# EasyEDA Pro project ProProject_训练营23_2023-12-06.epro, board PCB_PCB_不带频谱时钟_2_2023-11-23_2
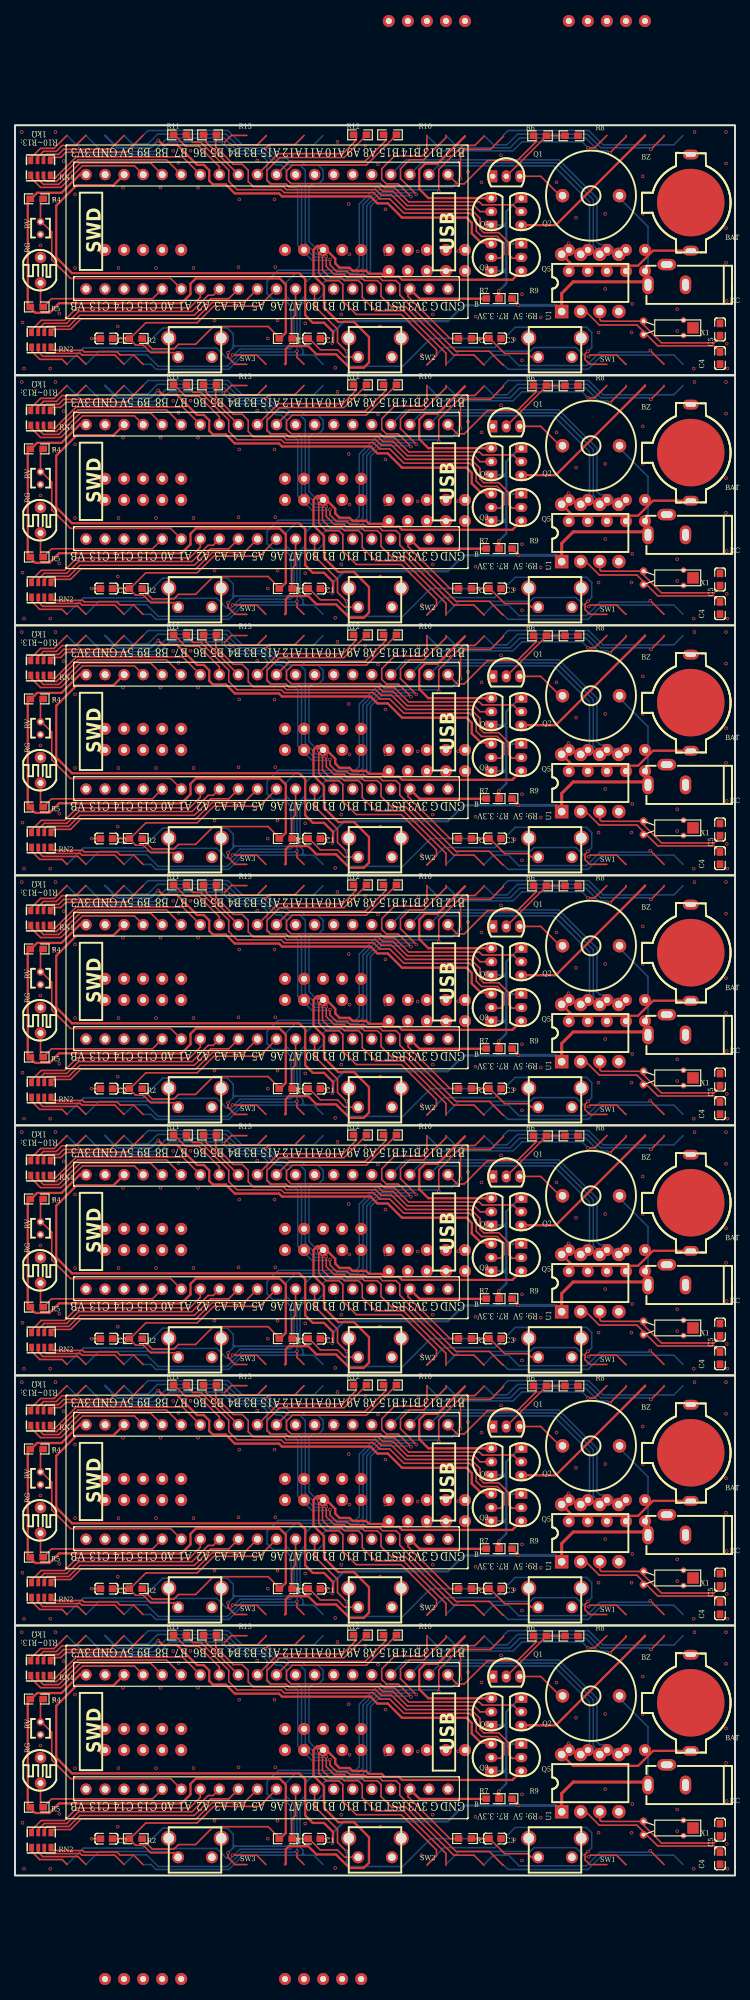
[diagram p3: board, top side]
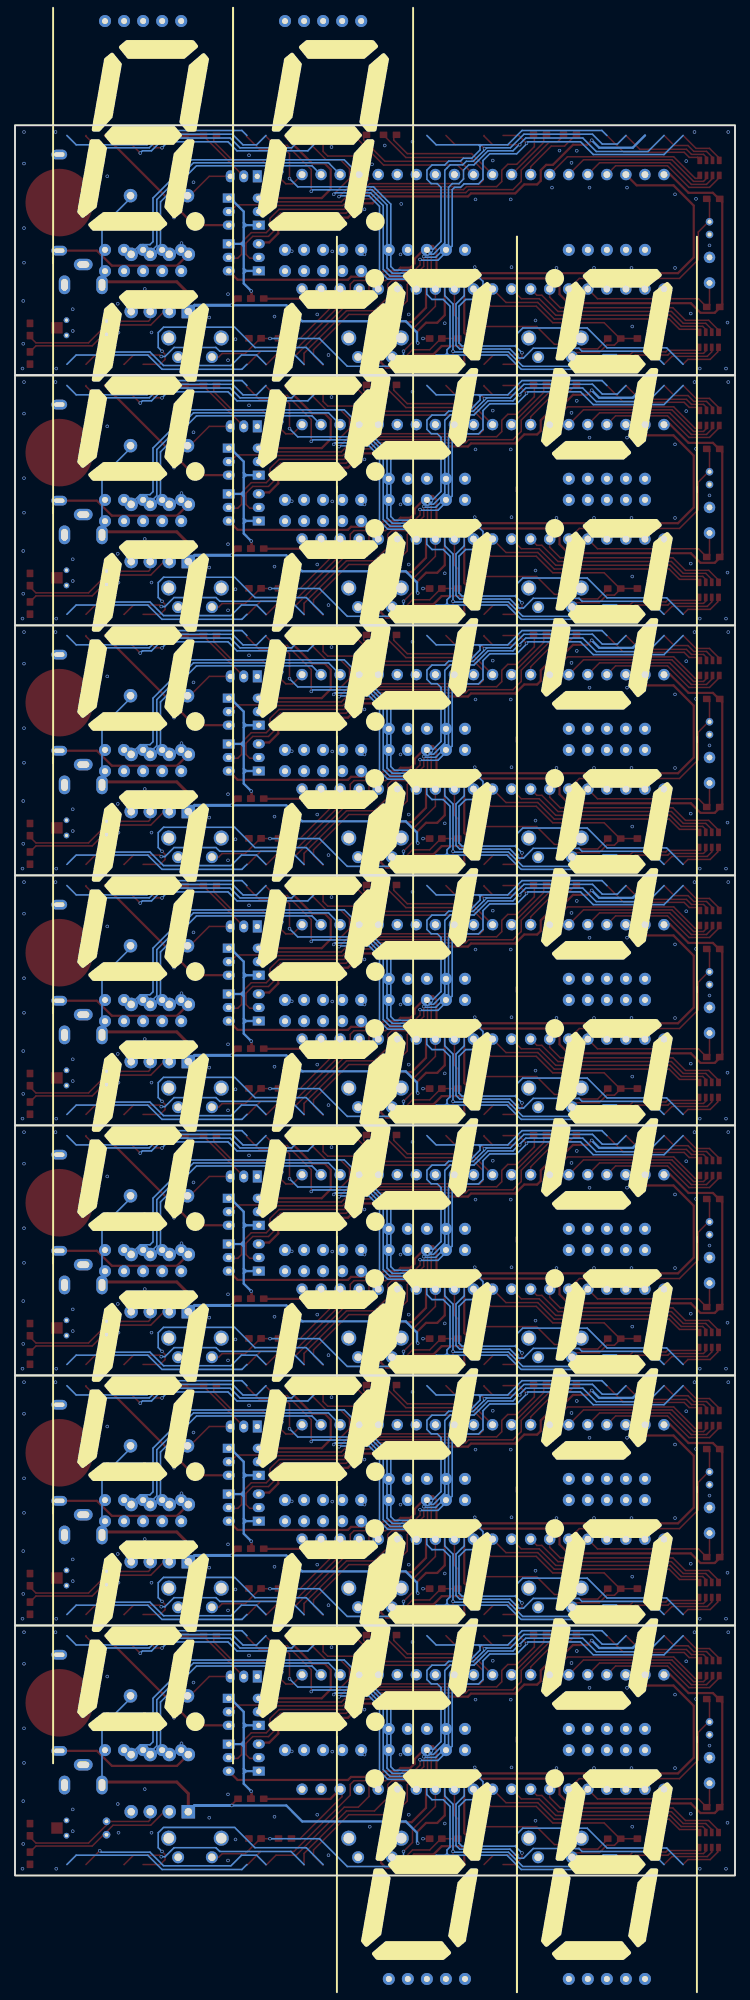
[diagram p4: board, bottom side, seen from below]

Outline 96 x 233.1 mm; copper layers: Top Layer, Bottom Layer. Coordinates in mm from the lower left corner of the outline.
Outline path: rectangle 0,233.1 96,199.8 ; rectangle 0,199.8 96,166.5 ; rectangle 0,166.5 96,133.2 ; rectangle 0,133.2 96,99.9 ; rectangle 0,99.9 96,66.6 ; rectangle 0,66.6 96,33.3 ; rectangle 0,33.3 96,0
Stack: Top Layer 0.035mm / Dielectric1 1.51mm FR4 er 4.5 / Bottom Layer 0.035mm

## Design rules (mm)
template: 用户自定义配置
spacing Default (default): track to track 0.152, other pairs 0 to 0.152
track width Default (default): min 0.152, default 0.203, max 25.4
differential pair differentialPair (default): width min 0.127, default 0.254, max 2.54; gap min 0.152, default 0.152
via Default (default): diameter min 0.45, default 0.45, max 100.025; hole min 0.3, default 0.3, max 59.995

## Placement (name value [footprint] x y rotation side)
B  -  [stm32f103c8t6核心板]  33.46 119.01 90 top
B#2  -  [stm32f103c8t6核心板]  33.46 85.71 90 top
B#3  -  [stm32f103c8t6核心板]  33.46 218.91 90 top
B#4  -  [stm32f103c8t6核心板]  33.46 185.61 90 top
B#5  -  [stm32f103c8t6核心板]  33.46 19.11 90 top
B#6  -  [stm32f103c8t6核心板]  33.46 152.31 90 top
B#7  -  [stm32f103c8t6核心板]  33.46 52.41 90 top
BAT  -  [bat-th_my-1220-01]  90.1 156.2 270 top
BAT#2  -  [bat-th_my-1220-01]  90.1 189.5 270 top
BAT#3  -  [bat-th_my-1220-01]  90.1 122.9 270 top
BAT#4  -  [bat-th_my-1220-01]  90.1 23 270 top
BAT#5  -  [bat-th_my-1220-01]  90.1 89.6 270 top
BAT#6  -  [bat-th_my-1220-01]  90.1 222.8 270 top
BAT#7  -  [bat-th_my-1220-01]  90.1 56.3 270 top
BZ  -  [BUZ-TH_BD12.0-P7.60-D0.6-FD]  76.8 23.92 180 top
BZ#2  -  [BUZ-TH_BD12.0-P7.60-D0.6-FD]  76.8 57.22 180 top
BZ#3  -  [BUZ-TH_BD12.0-P7.60-D0.6-FD]  76.8 223.72 180 top
BZ#4  -  [BUZ-TH_BD12.0-P7.60-D0.6-FD]  76.8 90.52 180 top
BZ#5  -  [BUZ-TH_BD12.0-P7.60-D0.6-FD]  76.8 123.82 180 top
BZ#6  -  [BUZ-TH_BD12.0-P7.60-D0.6-FD]  76.8 157.12 180 top
BZ#7  -  [BUZ-TH_BD12.0-P7.60-D0.6-FD]  76.8 190.42 180 top
C1  -  [C0603]  39.9 4.9 180 top
C1#2  -  [C0603]  39.9 38.2 180 top
C1#3  -  [C0603]  39.9 204.7 180 top
C1#4  -  [C0603]  39.9 71.5 180 top
C1#5  -  [C0603]  39.9 104.8 180 top
C1#6  -  [C0603]  39.9 138.1 180 top
C1#7  -  [C0603]  39.9 171.4 180 top
C2  -  [C0603]  12.2 204.7 0 top
C2#2  -  [C0603]  12.2 4.9 0 top
C2#3  -  [C0603]  12.2 38.2 0 top
C2#4  -  [C0603]  12.2 71.5 0 top
C2#5  -  [C0603]  12.2 104.8 0 top
C2#6  -  [C0603]  12.2 138.1 0 top
C2#7  -  [C0603]  12.2 171.4 0 top
C3  -  [C0603]  64 204.72 180 top
C3#2  -  [C0603]  64 4.92 180 top
C3#3  -  [C0603]  64 38.22 180 top
C3#4  -  [C0603]  64 71.52 180 top
C3#5  -  [C0603]  64 104.82 180 top
C3#6  -  [C0603]  64 138.12 180 top
C3#7  -  [C0603]  64 171.42 180 top
C4  -  [C0603]  94 2.3 90 top
C4#2  -  [C0603]  94 35.6 90 top
C4#3  -  [C0603]  94 202.1 90 top
C4#4  -  [C0603]  94 68.9 90 top
C4#5  -  [C0603]  94 102.2 90 top
C4#6  -  [C0603]  94 135.5 90 top
C4#7  -  [C0603]  94 168.8 90 top
C5  -  [C0603]  94 6.1 270 top
C5#2  -  [C0603]  94 39.4 270 top
C5#3  -  [C0603]  94 205.9 270 top
C5#4  -  [C0603]  94 72.7 270 top
C5#5  -  [C0603]  94 106 270 top
C5#6  -  [C0603]  94 139.3 270 top
C5#7  -  [C0603]  94 172.6 270 top
DC  -  [dc-in_dc-002-2.0a-1.65]  86.9 80 180 top
DC#2  -  [dc-in_dc-002-2.0a-1.65]  86.9 146.6 180 top
DC#3  -  [dc-in_dc-002-2.0a-1.65]  86.9 179.9 180 top
DC#4  -  [dc-in_dc-002-2.0a-1.65]  86.9 113.3 180 top
DC#5  -  [dc-in_dc-002-2.0a-1.65]  86.9 13.4 180 top
DC#6  -  [dc-in_dc-002-2.0a-1.65]  86.9 213.2 180 top
DC#7  -  [dc-in_dc-002-2.0a-1.65]  86.9 46.7 180 top
LED1  -  [1寸数码管]  84 16.7 180 bottom
LED1#2  -  [1寸数码管]  84 50 180 bottom
LED1#3  -  [1寸数码管]  84 216.5 180 bottom
LED1#4  -  [1寸数码管]  84 83.3 180 bottom
LED1#5  -  [1寸数码管]  84 116.6 180 bottom
LED1#6  -  [1寸数码管]  84 149.9 180 bottom
LED1#7  -  [1寸数码管]  84 183.2 180 bottom
LED2  -  [1寸数码管]  60 16.7 180 bottom
LED2#2  -  [1寸数码管]  60 50 180 bottom
LED2#3  -  [1寸数码管]  60 216.5 180 bottom
LED2#4  -  [1寸数码管]  60 83.3 180 bottom
LED2#5  -  [1寸数码管]  60 116.6 180 bottom
LED2#6  -  [1寸数码管]  60 149.9 180 bottom
LED2#7  -  [1寸数码管]  60 183.2 180 bottom
LED3  -  [1寸数码管]  36 50 0 bottom
LED3#2  -  [1寸数码管]  36 16.7 0 bottom
LED3#3  -  [1寸数码管]  36 216.5 0 bottom
LED3#4  -  [1寸数码管]  36 83.3 0 bottom
LED3#5  -  [1寸数码管]  36 116.6 0 bottom
LED3#6  -  [1寸数码管]  36 149.9 0 bottom
LED3#7  -  [1寸数码管]  36 183.2 0 bottom
LED4  -  [1寸数码管]  12 16.7 0 bottom
LED4#2  -  [1寸数码管]  12 50 0 bottom
LED4#3  -  [1寸数码管]  12 216.5 0 bottom
LED4#4  -  [1寸数码管]  12 83.3 0 bottom
LED4#5  -  [1寸数码管]  12 116.6 0 bottom
LED4#6  -  [1寸数码管]  12 149.9 0 bottom
LED4#7  -  [1寸数码管]  12 183.2 0 bottom
Q1  -  [s8050_to_92]  65.5 126.4 0 top
Q1#2  -  [s8050_to_92]  65.5 193 0 top
Q1#3  -  [s8050_to_92]  65.5 59.8 0 top
Q1#4  -  [s8050_to_92]  65.5 226.3 0 top
Q1#5  -  [s8050_to_92]  65.5 93.1 0 top
Q1#6  -  [s8050_to_92]  65.5 26.5 0 top
Q1#7  -  [s8050_to_92]  65.5 159.7 0 top
Q2  -  [s8550p_to-92]  67.5 121.7 270 top
Q2#2  -  [s8550p_to-92]  67.5 21.8 270 top
Q2#3  -  [s8550p_to-92]  67.5 221.6 270 top
Q2#4  -  [s8550p_to-92]  67.5 55.1 270 top
Q2#5  -  [s8550p_to-92]  67.5 155 270 top
Q2#6  -  [s8550p_to-92]  67.5 188.3 270 top
Q2#7  -  [s8550p_to-92]  67.5 88.4 270 top
Q3  -  [s8550p_to-92]  63.5 148.9 90 top
Q3#2  -  [s8550p_to-92]  63.5 115.6 90 top
Q3#3  -  [s8550p_to-92]  63.5 15.7 90 top
Q3#4  -  [s8550p_to-92]  63.5 49 90 top
Q3#5  -  [s8550p_to-92]  63.5 182.2 90 top
Q3#6  -  [s8550p_to-92]  63.5 82.3 90 top
Q3#7  -  [s8550p_to-92]  63.5 215.5 90 top
Q4  -  [s8550p_to-92]  63.5 55.1 90 top
Q4#2  -  [s8550p_to-92]  63.5 88.4 90 top
Q4#3  -  [s8550p_to-92]  63.5 221.6 90 top
Q4#4  -  [s8550p_to-92]  63.5 155 90 top
Q4#5  -  [s8550p_to-92]  63.5 188.3 90 top
Q4#6  -  [s8550p_to-92]  63.5 21.8 90 top
Q4#7  -  [s8550p_to-92]  63.5 121.7 90 top
Q5  -  [s8550p_to-92]  67.5 182.2 270 top
Q5#2  -  [s8550p_to-92]  67.5 215.5 270 top
Q5#3  -  [s8550p_to-92]  67.5 148.9 270 top
Q5#4  -  [s8550p_to-92]  67.5 82.3 270 top
Q5#5  -  [s8550p_to-92]  67.5 115.6 270 top
Q5#6  -  [s8550p_to-92]  67.5 15.7 270 top
Q5#7  -  [s8550p_to-92]  67.5 49 270 top
R1  -  [R0603]  36.1 204.7 180 top
R1#2  -  [R0603]  36.1 38.2 180 top
R1#3  -  [R0603]  36.1 71.5 180 top
R1#4  -  [R0603]  36.1 104.8 180 top
R1#5  -  [R0603]  36.1 4.9 180 top
R1#6  -  [R0603]  36.1 138.1 180 top
R1#7  -  [R0603]  36.1 171.4 180 top
R2  -  [R0603]  16.1 204.7 0 top
R2#2  -  [R0603]  16.1 38.2 0 top
R2#3  -  [R0603]  16.1 71.5 0 top
R2#4  -  [R0603]  16.1 171.4 0 top
R2#5  -  [R0603]  16.1 104.8 0 top
R2#6  -  [R0603]  16.1 4.9 0 top
R2#7  -  [R0603]  16.1 138.1 0 top
R3  -  [R0603]  60 204.72 180 top
R3#2  -  [R0603]  60 38.22 180 top
R3#3  -  [R0603]  60 71.52 180 top
R3#4  -  [R0603]  60 104.82 180 top
R3#5  -  [R0603]  60 4.92 180 top
R3#6  -  [R0603]  60 138.12 180 top
R3#7  -  [R0603]  60 171.42 180 top
R4  -  [R0603]  2.9 223.3 180 top
R4#2  -  [R0603]  2.9 23.5 180 top
R4#3  -  [R0603]  2.9 56.8 180 top
R4#4  -  [R0603]  2.9 90.1 180 top
R4#5  -  [R0603]  2.9 123.4 180 top
R4#6  -  [R0603]  2.9 156.7 180 top
R4#7  -  [R0603]  2.9 190 180 top
R5  -  [R0603]  2.9 208.9 180 top
R5#2  -  [R0603]  2.9 9.1 180 top
R5#3  -  [R0603]  2.9 42.4 180 top
R5#4  -  [R0603]  2.9 75.7 180 top
R5#5  -  [R0603]  2.9 109 180 top
R5#6  -  [R0603]  2.9 142.3 180 top
R5#7  -  [R0603]  2.9 175.6 180 top
R6  -  [R0603]  70 231.7 0 top
R6#2  -  [R0603]  70 31.9 0 top
R6#3  -  [R0603]  70 65.2 0 top
R6#4  -  [R0603]  70 98.5 0 top
R6#5  -  [R0603]  70 131.8 0 top
R6#6  -  [R0603]  70 165.1 0 top
R6#7  -  [R0603]  70 198.4 0 top
R7  -  [r0603]  63.7 110.12 180 top
R7#2  -  [r0603]  63.7 10.22 180 top
R7#3  -  [r0603]  63.7 43.52 180 top
R7#4  -  [r0603]  63.7 143.42 180 top
R7#5  -  [r0603]  63.7 76.82 180 top
R7#6  -  [r0603]  63.7 176.72 180 top
R7#7  -  [r0603]  63.7 210.02 180 top
R8  -  [R0603]  74.2 65.2 180 top
R8#2  -  [R0603]  74.2 98.5 180 top
R8#3  -  [R0603]  74.2 231.7 180 top
R8#4  -  [R0603]  74.2 131.8 180 top
R8#5  -  [R0603]  74.2 31.9 180 top
R8#6  -  [R0603]  74.2 165.1 180 top
R8#7  -  [R0603]  74.2 198.4 180 top
R9  -  [r0603]  65.4 210.02 0 top
R9#2  -  [r0603]  65.4 110.12 0 top
R9#3  -  [r0603]  65.4 176.72 0 top
R9#4  -  [r0603]  65.4 143.42 0 top
R9#5  -  [r0603]  65.4 43.52 0 top
R9#6  -  [r0603]  65.4 76.82 0 top
R9#7  -  [r0603]  65.4 10.22 0 top
R10  -  [R0603]  50 231.82 180 top
R10#2  -  [R0603]  50 65.32 180 top
R10#3  -  [R0603]  50 98.62 180 top
R10#4  -  [R0603]  50 32.02 180 top
R10#5  -  [R0603]  50 131.92 180 top
R10#6  -  [R0603]  50 165.22 180 top
R10#7  -  [R0603]  50 198.52 180 top
R11  -  [R0603]  22 231.82 180 top
R11#2  -  [R0603]  22 65.32 180 top
R11#3  -  [R0603]  22 98.62 180 top
R11#4  -  [R0603]  22 32.02 180 top
R11#5  -  [R0603]  22 131.92 180 top
R11#6  -  [R0603]  22 165.22 180 top
R11#7  -  [R0603]  22 198.52 180 top
R12  -  [R0603]  46 65.32 180 top
R12#2  -  [R0603]  46 231.82 180 top
R12#3  -  [R0603]  46 98.62 180 top
R12#4  -  [R0603]  46 131.92 180 top
R12#5  -  [R0603]  46 32.02 180 top
R12#6  -  [R0603]  46 165.22 180 top
R12#7  -  [R0603]  46 198.52 180 top
R13  -  [R0603]  26 231.82 180 top
R13#2  -  [R0603]  26 65.32 180 top
R13#3  -  [R0603]  26 98.62 180 top
R13#4  -  [R0603]  26 32.02 180 top
R13#5  -  [R0603]  26 131.92 180 top
R13#6  -  [R0603]  26 165.22 180 top
R13#7  -  [R0603]  26 198.52 180 top
RG  -  [res-th_l5.1-w4.3-p3.40-d0.5]  3.4 213.8 180 top
RG#2  -  [res-th_l5.1-w4.3-p3.40-d0.5]  3.4 180.5 180 top
RG#3  -  [res-th_l5.1-w4.3-p3.40-d0.5]  3.4 14 180 top
RG#4  -  [res-th_l5.1-w4.3-p3.40-d0.5]  3.4 113.9 180 top
RG#5  -  [res-th_l5.1-w4.3-p3.40-d0.5]  3.4 47.3 180 top
RG#6  -  [res-th_l5.1-w4.3-p3.40-d0.5]  3.4 147.2 180 top
RG#7  -  [res-th_l5.1-w4.3-p3.40-d0.5]  3.4 80.6 180 top
RN1  -  [RES-ARRAY-SMD_0603-8P-L3.2-W1.6-BL]  3.4 127.52 0 top
RN1#2  -  [RES-ARRAY-SMD_0603-8P-L3.2-W1.6-BL]  3.4 227.42 0 top
RN1#3  -  [RES-ARRAY-SMD_0603-8P-L3.2-W1.6-BL]  3.4 27.62 0 top
RN1#4  -  [RES-ARRAY-SMD_0603-8P-L3.2-W1.6-BL]  3.4 60.92 0 top
RN1#5  -  [RES-ARRAY-SMD_0603-8P-L3.2-W1.6-BL]  3.4 94.22 0 top
RN1#6  -  [RES-ARRAY-SMD_0603-8P-L3.2-W1.6-BL]  3.4 160.82 0 top
RN1#7  -  [RES-ARRAY-SMD_0603-8P-L3.2-W1.6-BL]  3.4 194.12 0 top
RN2  -  [RES-ARRAY-SMD_0603-8P-L3.2-W1.6-BL]  3.5 4.72 0 top
RN2#2  -  [RES-ARRAY-SMD_0603-8P-L3.2-W1.6-BL]  3.5 38.02 0 top
RN2#3  -  [RES-ARRAY-SMD_0603-8P-L3.2-W1.6-BL]  3.5 204.52 0 top
RN2#4  -  [RES-ARRAY-SMD_0603-8P-L3.2-W1.6-BL]  3.5 71.32 0 top
RN2#5  -  [RES-ARRAY-SMD_0603-8P-L3.2-W1.6-BL]  3.5 104.62 0 top
RN2#6  -  [RES-ARRAY-SMD_0603-8P-L3.2-W1.6-BL]  3.5 137.92 0 top
RN2#7  -  [RES-ARRAY-SMD_0603-8P-L3.2-W1.6-BL]  3.5 171.22 0 top
RV  -  [RES-TH_L2.5-W2.5-P1.70-D0.3]  3.4 119.5 90 top
RV#2  -  [RES-TH_L2.5-W2.5-P1.70-D0.3]  3.4 219.4 90 top
RV#3  -  [RES-TH_L2.5-W2.5-P1.70-D0.3]  3.4 52.9 90 top
RV#4  -  [RES-TH_L2.5-W2.5-P1.70-D0.3]  3.4 86.2 90 top
RV#5  -  [RES-TH_L2.5-W2.5-P1.70-D0.3]  3.4 19.6 90 top
RV#6  -  [RES-TH_L2.5-W2.5-P1.70-D0.3]  3.4 152.8 90 top
RV#7  -  [RES-TH_L2.5-W2.5-P1.70-D0.3]  3.4 186.1 90 top
SW1  -  [KEY-TH_4P-SKHHLQA010]  72 3.7 0 top
SW1#2  -  [KEY-TH_4P-SKHHLQA010]  72 37 0 top
SW1#3  -  [KEY-TH_4P-SKHHLQA010]  72 203.5 0 top
SW1#4  -  [KEY-TH_4P-SKHHLQA010]  72 70.3 0 top
SW1#5  -  [KEY-TH_4P-SKHHLQA010]  72 103.6 0 top
SW1#6  -  [KEY-TH_4P-SKHHLQA010]  72 136.9 0 top
SW1#7  -  [KEY-TH_4P-SKHHLQA010]  72 170.2 0 top
SW2  -  [KEY-TH_4P-SKHHLQA010]  48 203.5 0 top
SW2#2  -  [KEY-TH_4P-SKHHLQA010]  48 3.7 0 top
SW2#3  -  [KEY-TH_4P-SKHHLQA010]  48 37 0 top
SW2#4  -  [KEY-TH_4P-SKHHLQA010]  48 70.3 0 top
SW2#5  -  [KEY-TH_4P-SKHHLQA010]  48 103.6 0 top
SW2#6  -  [KEY-TH_4P-SKHHLQA010]  48 136.9 0 top
SW2#7  -  [KEY-TH_4P-SKHHLQA010]  48 170.2 0 top
SW3  -  [KEY-TH_4P-SKHHLQA010]  24 203.5 0 top
SW3#2  -  [KEY-TH_4P-SKHHLQA010]  24 3.7 0 top
SW3#3  -  [KEY-TH_4P-SKHHLQA010]  24 37 0 top
SW3#4  -  [KEY-TH_4P-SKHHLQA010]  24 70.3 0 top
SW3#5  -  [KEY-TH_4P-SKHHLQA010]  24 103.6 0 top
SW3#6  -  [KEY-TH_4P-SKHHLQA010]  24 136.9 0 top
SW3#7  -  [KEY-TH_4P-SKHHLQA010]  24 170.2 0 top
U1  -  [dip-8_l9.7-w6.4-p2.54-ls7.6-bl]  76.7 112.2 0 top
U1#2  -  [dip-8_l9.7-w6.4-p2.54-ls7.6-bl]  76.7 178.8 0 top
U1#3  -  [dip-8_l9.7-w6.4-p2.54-ls7.6-bl]  76.7 212.1 0 top
U1#4  -  [dip-8_l9.7-w6.4-p2.54-ls7.6-bl]  76.7 45.6 0 top
U1#5  -  [dip-8_l9.7-w6.4-p2.54-ls7.6-bl]  76.7 145.5 0 top
U1#6  -  [dip-8_l9.7-w6.4-p2.54-ls7.6-bl]  76.7 12.3 0 top
U1#7  -  [dip-8_l9.7-w6.4-p2.54-ls7.6-bl]  76.7 78.9 0 top
X1  -  [CRYSTAL-TH_BD2.1-P0.70-D0.3]  83.8 206.12 180 top
X1#2  -  [CRYSTAL-TH_BD2.1-P0.70-D0.3]  83.8 6.32 180 top
X1#3  -  [CRYSTAL-TH_BD2.1-P0.70-D0.3]  83.8 39.62 180 top
X1#4  -  [CRYSTAL-TH_BD2.1-P0.70-D0.3]  83.8 72.92 180 top
X1#5  -  [CRYSTAL-TH_BD2.1-P0.70-D0.3]  83.8 106.22 180 top
X1#6  -  [CRYSTAL-TH_BD2.1-P0.70-D0.3]  83.8 139.52 180 top
X1#7  -  [CRYSTAL-TH_BD2.1-P0.70-D0.3]  83.8 172.82 180 top

## Footprints (pads in the part's own frame, mm; a bottom-side part is the same pattern mirrored in y, then rotated)
1寸数码管
  round 1.6 hole 0.8: 1(0,0) 2(2.54,0) 3(5.08,0) 4(7.62,0) 5(10.16,0) 6(10.16,30.48) 7(7.62,30.48) 8(5.08,30.48) 9(2.54,30.48) 10(0,30.48)
bat-th_my-1220-01
  oval 1.3x2.1 hole 0.6x1.4: 1(-6.4,0) 1(6.4,0)
  round 9 smd: 2(0,0)
BUZ-TH_BD12.0-P7.60-D0.6-FD
  round 1.8 hole 1: 1(-3.8,0) 2(3.8,0)
C0603
  rrect 1.016x0.9 smd: 1(-0.813,0) 2(0.813,0)
CRYSTAL-TH_BD2.1-P0.70-D0.3
  oval 1.016x1.016 hole 0.5: 1(0,0.889) 2(0,-0.889)
  rect 1.524x1.524 smd: 3(-6.604,0)
  round 0.762 hole 0.406: 3(-5.334,1.016) 3(-5.334,-1.016)
dc-in_dc-002-2.0a-1.65
  oval 1.524x2.5 hole 0.9x1.6: 1(2.5,1.35) 2(-2.5,1.35)
  oval 2.5x1.524 hole 1.6x0.9: 3(0,-1.35)
dip-8_l9.7-w6.4-p2.54-ls7.6-bl
  rect 1.8x1.8 hole 1: 1(-3.81,-3.81)
  round 1.8 hole 1: 2(-1.27,-3.81) 3(1.27,-3.81) 4(3.81,-3.81) 5(3.81,3.81) 6(1.27,3.81) 7(-1.27,3.81) 8(-3.81,3.81)
KEY-TH_4P-SKHHLQA010
  round 1.6 hole 1: 1(-2.25,-1.27) 2(2.25,-1.27)
  round 2 hole 1.4: 3(3.5,1.27) 4(-3.5,1.27)
r0603
  rrect 1.016x0.864 smd: 1(-0.864,0) 2(0.864,0)
R0603
  rrect 1.016x0.864 smd: 1(-0.864,0) 2(0.864,0)
RES-ARRAY-SMD_0603-8P-L3.2-W1.6-BL
  rrect 0.65x1 smd: 1(-1.3,-1) 4(1.3,-1) 5(1.3,1) 8(-1.3,1)
  rrect 0.5x1 smd: 2(-0.4,-1) 3(0.4,-1) 6(0.4,1) 7(-0.4,1)
RES-TH_L2.5-W2.5-P1.70-D0.3
  round 1 hole 0.55: 1(-0.85,0) 2(0.85,0)
res-th_l5.1-w4.3-p3.40-d0.5
  round 1.524 hole 0.762x0.767: 1(0,-1.7) 2(0,1.7)
s8050_to_92
  rect 1.2x1.6 hole 0.701: 1(-1.8,0)
  oval 1.2x1.6 hole 0.701: 2(0,0) 3(1.8,0)
s8550p_to-92
  rect 1.2x1.6 hole 0.7: 1(-1.8,0)
  oval 1.2x1.6 hole 0.7: 2(0,0) 3(1.8,0)
stm32f103c8t6核心板
  round 1.524 hole 0.914: 1(-7.62,23.993) 2(-7.62,21.453) 3(-7.62,18.913) 4(-7.62,16.373) 5(-7.62,13.833) 6(-7.62,11.293) 7(-7.62,8.753) 8(-7.62,6.213) 9(-7.62,3.673) 10(-7.62,1.133) 11(-7.62,-1.407) 12(-7.62,-3.947) 13(-7.62,-6.487) 14(-7.62,-9.027) 15(-7.62,-11.567) 16(-7.62,-14.107) 17(-7.62,-16.647) 18(-7.62,-19.187) 19(-7.62,-21.727) 20(-7.62,-24.267) 21(7.62,-24.267) 22(7.62,-21.727) 23(7.62,-19.187) 24(7.62,-16.647) 25(7.62,-14.107) 26(7.62,-11.567) 27(7.62,-9.027) 28(7.62,-6.487) 29(7.62,-3.947) 30(7.62,-1.407) 31(7.62,1.133) 32(7.62,3.673) 33(7.62,6.213) 34(7.62,8.753) 35(7.62,11.293) 36(7.62,13.833) 37(7.62,16.373) 38(7.62,18.913) 39(7.62,21.453) 40(7.62,23.993)

## Nets
3V3: B.18 B.40 B#2.18 B#2.40 B#3.18 B#3.40 B#4.18 B#4.40 B#5.18 B#5.40 B#6.18 B#6.40 B#7.18 B#7.40 R1.2 R1#2.2 R1#3.2 R1#4.2 R1#5.2 R1#6.2 R1#7.2 R2.2 R2#2.2 R2#3.2 R2#4.2 R2#5.2 R2#6.2 R2#7.2 R3.2 R3#2.2 R3#3.2 R3#4.2 R3#5.2 R3#6.2 R3#7.2 R4.2 R4#2.2 R4#3.2 R4#4.2 R4#5.2 R4#6.2 R4#7.2 R5.2 R5#2.2 R5#3.2 R5#4.2 R5#5.2 R5#6.2 R5#7.2 R7.2 R7#2.2 R7#3.2 R7#4.2 R7#5.2 R7#6.2 R7#7.2
3V32: Q2.1 Q2#2.1 Q2#3.1 Q2#4.1 Q2#5.1 Q2#6.1 Q2#7.1 Q3.1 Q3#2.1 Q3#3.1 Q3#4.1 Q3#5.1 Q3#6.1 Q3#7.1 Q4.1 Q4#2.1 Q4#3.1 Q4#4.1 Q4#5.1 Q4#6.1 Q4#7.1 Q5.1 Q5#2.1 Q5#3.1 Q5#4.1 Q5#5.1 Q5#6.1 Q5#7.1 R7.1 R7#2.1 R7#3.1 R7#4.1 R7#5.1 R7#6.1 R7#7.1 R9.1 R9#2.1 R9#3.1 R9#4.1 R9#5.1 R9#6.1 R9#7.1
GND: B.19 B.20 B.39 B#2.19 B#2.20 B#2.39 B#3.19 B#3.20 B#3.39 B#4.19 B#4.20 B#4.39 B#5.19 B#5.20 B#5.39 B#6.19 B#6.20 B#6.39 B#7.19 B#7.20 B#7.39 BAT.2 BAT#2.2 BAT#3.2 BAT#4.2 BAT#5.2 BAT#6.2 BAT#7.2 C1.1 C1#2.1 C1#3.1 C1#4.1 C1#5.1 C1#6.1 C1#7.1 C2.1 C2#2.1 C2#3.1 C2#4.1 C2#5.1 C2#6.1 C2#7.1 C3.1 C3#2.1 C3#3.1 C3#4.1 C3#5.1 C3#6.1 C3#7.1 C4.1 C4#2.1 C4#3.1 C4#4.1 C4#5.1 C4#6.1 C4#7.1 C5.1 C5#2.1 C5#3.1 C5#4.1 C5#5.1 C5#6.1 C5#7.1 DC.2 DC.3 DC#2.2 DC#2.3 DC#3.2 DC#3.3 DC#4.2 DC#4.3 DC#5.2 DC#5.3 DC#6.2 DC#6.3 DC#7.2 DC#7.3 Q1.1 Q1#2.1 Q1#3.1 Q1#4.1 Q1#5.1 Q1#6.1 Q1#7.1 R8.1 R8#2.1 R8#3.1 R8#4.1 R8#5.1 R8#6.1 R8#7.1 RG.1 RG#2.1 RG#3.1 RG#4.1 RG#5.1 RG#6.1 RG#7.1 RV.1 RV#2.1 RV#3.1 RV#4.1 RV#5.1 RV#6.1 RV#7.1 SW1.2 SW1.3 SW1.4 SW1#2.2 SW1#2.3 SW1#2.4 SW1#3.2 SW1#3.3 SW1#3.4 SW1#4.2 SW1#4.3 SW1#4.4 SW1#5.2 SW1#5.3 SW1#5.4 SW1#6.2 SW1#6.3 SW1#6.4 SW1#7.2 SW1#7.3 SW1#7.4 SW2.2 SW2.3 SW2.4 SW2#2.2 SW2#2.3 SW2#2.4 SW2#3.2 SW2#3.3 SW2#3.4 SW2#4.2 SW2#4.3 SW2#4.4 SW2#5.2 SW2#5.3 SW2#5.4 SW2#6.2 SW2#6.3 SW2#6.4 SW2#7.2 SW2#7.3 SW2#7.4 SW3.2 SW3.3 SW3.4 SW3#2.2 SW3#2.3 SW3#2.4 SW3#3.2 SW3#3.3 SW3#3.4 SW3#4.2 SW3#4.3 SW3#4.4 SW3#5.2 SW3#5.3 SW3#5.4 SW3#6.2 SW3#6.3 SW3#6.4 SW3#7.2 SW3#7.3 SW3#7.4 U1.4 U1#2.4 U1#3.4 U1#4.4 U1#5.4 U1#6.4 U1#7.4 X1.3 X1#2.3 X1#3.3 X1#4.3 X1#5.3 X1#6.3 X1#7.3
VCC: B.38 B#2.38 B#3.38 B#4.38 B#5.38 B#6.38 B#7.38 BZ.1 BZ#2.1 BZ#3.1 BZ#4.1 BZ#5.1 BZ#6.1 BZ#7.1 DC.1 DC#2.1 DC#3.1 DC#4.1 DC#5.1 DC#6.1 DC#7.1 R9.2 R9#2.2 R9#3.2 R9#4.2 R9#5.2 R9#6.2 R9#7.2 U1.1 U1#2.1 U1#3.1 U1#4.1 U1#5.1 U1#6.1 U1#7.1
A: LED1.7 LED1#2.7 LED1#3.7 LED1#4.7 LED1#5.7 LED1#6.7 LED1#7.7 LED2.7 LED2#2.7 LED2#3.7 LED2#4.7 LED2#5.7 LED2#6.7 LED2#7.7 LED3.7 LED3#2.7 LED3#3.7 LED3#4.7 LED3#5.7 LED3#6.7 LED3#7.7 LED4.7 LED4#2.7 LED4#3.7 LED4#4.7 LED4#5.7 LED4#6.7 LED4#7.7 RN2.3 RN2#2.3 RN2#3.3 RN2#4.3 RN2#5.3 RN2#6.3 RN2#7.3
B: LED1.6 LED1#2.6 LED1#3.6 LED1#4.6 LED1#5.6 LED1#6.6 LED1#7.6 LED2.6 LED2#2.6 LED2#3.6 LED2#4.6 LED2#5.6 LED2#6.6 LED2#7.6 LED3.6 LED3#2.6 LED3#3.6 LED3#4.6 LED3#5.6 LED3#6.6 LED3#7.6 LED4.6 LED4#2.6 LED4#3.6 LED4#4.6 LED4#5.6 LED4#6.6 LED4#7.6 RN2.4 RN2#2.4 RN2#3.4 RN2#4.4 RN2#5.4 RN2#6.4 RN2#7.4
BEEP: B.21 B#2.21 B#3.21 B#4.21 B#5.21 B#6.21 B#7.21 R6.1 R6#2.1 R6#3.1 R6#4.1 R6#5.1 R6#6.1 R6#7.1
C: LED1.4 LED1#2.4 LED1#3.4 LED1#4.4 LED1#5.4 LED1#6.4 LED1#7.4 LED2.4 LED2#2.4 LED2#3.4 LED2#4.4 LED2#5.4 LED2#6.4 LED2#7.4 LED3.4 LED3#2.4 LED3#3.4 LED3#4.4 LED3#5.4 LED3#6.4 LED3#7.4 LED4.4 LED4#2.4 LED4#3.4 LED4#4.4 LED4#5.4 LED4#6.4 LED4#7.4 RN1.6 RN1#2.6 RN1#3.6 RN1#4.6 RN1#5.6 RN1#6.6 RN1#7.6
COM1: B.30 B#2.30 B#3.30 B#4.30 B#5.30 B#6.30 B#7.30 R10.2 R10#2.2 R10#3.2 R10#4.2 R10#5.2 R10#6.2 R10#7.2
COM2: B.31 B#2.31 B#3.31 B#4.31 B#5.31 B#6.31 B#7.31 R12.2 R12#2.2 R12#3.2 R12#4.2 R12#5.2 R12#6.2 R12#7.2
COM3: B.32 B#2.32 B#3.32 B#4.32 B#5.32 B#6.32 B#7.32 R13.2 R13#2.2 R13#3.2 R13#4.2 R13#5.2 R13#6.2 R13#7.2
COM4: B.33 B#2.33 B#3.33 B#4.33 B#5.33 B#6.33 B#7.33 R11.2 R11#2.2 R11#3.2 R11#4.2 R11#5.2 R11#6.2 R11#7.2
D: LED1.2 LED1#2.2 LED1#3.2 LED1#4.2 LED1#5.2 LED1#6.2 LED1#7.2 LED2.2 LED2#2.2 LED2#3.2 LED2#4.2 LED2#5.2 LED2#6.2 LED2#7.2 LED3.2 LED3#2.2 LED3#3.2 LED3#4.2 LED3#5.2 LED3#6.2 LED3#7.2 LED4.2 LED4#2.2 LED4#3.2 LED4#4.2 LED4#5.2 LED4#6.2 LED4#7.2 RN1.7 RN1#2.7 RN1#3.7 RN1#4.7 RN1#5.7 RN1#6.7 RN1#7.7
DP: LED1.5 LED1#2.5 LED1#3.5 LED1#4.5 LED1#5.5 LED1#6.5 LED1#7.5 LED2.5 LED2#2.5 LED2#3.5 LED2#4.5 LED2#5.5 LED2#6.5 LED2#7.5 LED3.5 LED3#2.5 LED3#3.5 LED3#4.5 LED3#5.5 LED3#6.5 LED3#7.5 LED4.5 LED4#2.5 LED4#3.5 LED4#4.5 LED4#5.5 LED4#6.5 LED4#7.5 RN1.5 RN1#2.5 RN1#3.5 RN1#4.5 RN1#5.5 RN1#6.5 RN1#7.5
DS_DAT: B.23 B#2.23 B#3.23 B#4.23 B#5.23 B#6.23 B#7.23 U1.6 U1#2.6 U1#3.6 U1#4.6 U1#5.6 U1#6.6 U1#7.6
DS_RST: B.24 B#2.24 B#3.24 B#4.24 B#5.24 B#6.24 B#7.24 U1.5 U1#2.5 U1#3.5 U1#4.5 U1#5.5 U1#6.5 U1#7.5
DS_SCK: B.22 B#2.22 B#3.22 B#4.22 B#5.22 B#6.22 B#7.22 U1.7 U1#2.7 U1#3.7 U1#4.7 U1#5.7 U1#6.7 U1#7.7
E: LED1.1 LED1#2.1 LED1#3.1 LED1#4.1 LED1#5.1 LED1#6.1 LED1#7.1 LED2.1 LED2#2.1 LED2#3.1 LED2#4.1 LED2#5.1 LED2#6.1 LED2#7.1 LED3.1 LED3#2.1 LED3#3.1 LED3#4.1 LED3#5.1 LED3#6.1 LED3#7.1 LED4.1 LED4#2.1 LED4#3.1 LED4#4.1 LED4#5.1 LED4#6.1 LED4#7.1 RN1.8 RN1#2.8 RN1#3.8 RN1#4.8 RN1#5.8 RN1#6.8 RN1#7.8
F: LED1.9 LED1#2.9 LED1#3.9 LED1#4.9 LED1#5.9 LED1#6.9 LED1#7.9 LED2.9 LED2#2.9 LED2#3.9 LED2#4.9 LED2#5.9 LED2#6.9 LED2#7.9 LED3.9 LED3#2.9 LED3#3.9 LED3#4.9 LED3#5.9 LED3#6.9 LED3#7.9 LED4.9 LED4#2.9 LED4#3.9 LED4#4.9 LED4#5.9 LED4#6.9 LED4#7.9 RN2.2 RN2#2.2 RN2#3.2 RN2#4.2 RN2#5.2 RN2#6.2 RN2#7.2
G: LED1.10 LED1#2.10 LED1#3.10 LED1#4.10 LED1#5.10 LED1#6.10 LED1#7.10 LED2.10 LED2#2.10 LED2#3.10 LED2#4.10 LED2#5.10 LED2#6.10 LED2#7.10 LED3.10 LED3#2.10 LED3#3.10 LED3#4.10 LED3#5.10 LED3#6.10 LED3#7.10 LED4.10 LED4#2.10 LED4#3.10 LED4#4.10 LED4#5.10 LED4#6.10 LED4#7.10 RN2.1 RN2#2.1 RN2#3.1 RN2#4.1 RN2#5.1 RN2#6.1 RN2#7.1
GM: B.5 B#2.5 B#3.5 B#4.5 B#5.5 B#6.5 B#7.5 R5.1 R5#2.1 R5#3.1 R5#4.1 R5#5.1 R5#6.1 R5#7.1 RG.2 RG#2.2 RG#3.2 RG#4.2 RG#5.2 RG#6.2 RG#7.2
KEY1: B.13 B#2.13 B#3.13 B#4.13 B#5.13 B#6.13 B#7.13 C3.2 C3#2.2 C3#3.2 C3#4.2 C3#5.2 C3#6.2 C3#7.2 R3.1 R3#2.1 R3#3.1 R3#4.1 R3#5.1 R3#6.1 R3#7.1 SW1.1 SW1#2.1 SW1#3.1 SW1#4.1 SW1#5.1 SW1#6.1 SW1#7.1
KEY2: B.12 B#2.12 B#3.12 B#4.12 B#5.12 B#6.12 B#7.12 C1.2 C1#2.2 C1#3.2 C1#4.2 C1#5.2 C1#6.2 C1#7.2 R1.1 R1#2.1 R1#3.1 R1#4.1 R1#5.1 R1#6.1 R1#7.1 SW2.1 SW2#2.1 SW2#3.1 SW2#4.1 SW2#5.1 SW2#6.1 SW2#7.1
KEY3: B.11 B#2.11 B#3.11 B#4.11 B#5.11 B#6.11 B#7.11 C2.2 C2#2.2 C2#3.2 C2#4.2 C2#5.2 C2#6.2 C2#7.2 R2.1 R2#2.1 R2#3.1 R2#4.1 R2#5.1 R2#6.1 R2#7.1 SW3.1 SW3#2.1 SW3#3.1 SW3#4.1 SW3#5.1 SW3#6.1 SW3#7.1
LEDCOM1: LED1.8 LED1#2.8 LED1#3.8 LED1#4.8 LED1#5.8 LED1#6.8 LED1#7.8 Q2.3 Q2#2.3 Q2#3.3 Q2#4.3 Q2#5.3 Q2#6.3 Q2#7.3
LEDCOM2: LED2.8 LED2#2.8 LED2#3.8 LED2#4.8 LED2#5.8 LED2#6.8 LED2#7.8 Q4.3 Q4#2.3 Q4#3.3 Q4#4.3 Q4#5.3 Q4#6.3 Q4#7.3
LEDCOM3: LED3.8 LED3#2.8 LED3#3.8 LED3#4.8 LED3#5.8 LED3#6.8 LED3#7.8 Q5.3 Q5#2.3 Q5#3.3 Q5#4.3 Q5#5.3 Q5#6.3 Q5#7.3
LEDCOM4: LED4.3 LED4#2.3 LED4#3.3 LED4#4.3 LED4#5.3 LED4#6.3 LED4#7.3 Q3.3 Q3#2.3 Q3#3.3 Q3#4.3 Q3#5.3 Q3#6.3 Q3#7.3
RM: B.6 B#2.6 B#3.6 B#4.6 B#5.6 B#6.6 B#7.6 R4.1 R4#2.1 R4#3.1 R4#4.1 R4#5.1 R4#6.1 R4#7.1 RV.2 RV#2.2 RV#3.2 RV#4.2 RV#5.2 RV#6.2 RV#7.2
$1N45: BZ.2 BZ#2.2 BZ#3.2 BZ#4.2 BZ#5.2 BZ#6.2 BZ#7.2 Q1.3 Q1#2.3 Q1#3.3 Q1#4.3 Q1#5.3 Q1#6.3 Q1#7.3
$1N120: BAT.1 BAT#2.1 BAT#3.1 BAT#4.1 BAT#5.1 BAT#6.1 BAT#7.1 U1.8 U1#2.8 U1#3.8 U1#4.8 U1#5.8 U1#6.8 U1#7.8
$1N175: C4.2 C4#2.2 C4#3.2 C4#4.2 C4#5.2 C4#6.2 C4#7.2 U1.2 U1#2.2 U1#3.2 U1#4.2 U1#5.2 U1#6.2 U1#7.2 X1.1 X1#2.1 X1#3.1 X1#4.1 X1#5.1 X1#6.1 X1#7.1
$1N176: C5.2 C5#2.2 C5#3.2 C5#4.2 C5#5.2 C5#6.2 C5#7.2 U1.3 U1#2.3 U1#3.3 U1#4.3 U1#5.3 U1#6.3 U1#7.3 X1.2 X1#2.2 X1#3.2 X1#4.2 X1#5.2 X1#6.2 X1#7.2
$1N3437: Q1.2 Q1#2.2 Q1#3.2 Q1#4.2 Q1#5.2 Q1#6.2 Q1#7.2 R6.2 R6#2.2 R6#3.2 R6#4.2 R6#5.2 R6#6.2 R6#7.2 R8.2 R8#2.2 R8#3.2 R8#4.2 R8#5.2 R8#6.2 R8#7.2
$1N3552: Q2.2 Q2#2.2 Q2#3.2 Q2#4.2 Q2#5.2 Q2#6.2 Q2#7.2 R10.1 R10#2.1 R10#3.1 R10#4.1 R10#5.1 R10#6.1 R10#7.1
$1N3648: Q3.2 Q3#2.2 Q3#3.2 Q3#4.2 Q3#5.2 Q3#6.2 Q3#7.2 R11.1 R11#2.1 R11#3.1 R11#4.1 R11#5.1 R11#6.1 R11#7.1
$1N3719: Q4.2 Q4#2.2 Q4#3.2 Q4#4.2 Q4#5.2 Q4#6.2 Q4#7.2 R12.1 R12#2.1 R12#3.1 R12#4.1 R12#5.1 R12#6.1 R12#7.1
$1N3790: Q5.2 Q5#2.2 Q5#3.2 Q5#4.2 Q5#5.2 Q5#6.2 Q5#7.2 R13.1 R13#2.1 R13#3.1 R13#4.1 R13#5.1 R13#6.1 R13#7.1
$1N4595: B.37 B#2.37 B#3.37 B#4.37 B#5.37 B#6.37 B#7.37 RN1.1 RN1#2.1 RN1#3.1 RN1#4.1 RN1#5.1 RN1#6.1 RN1#7.1
$1N4627: B.36 B#2.36 B#3.36 B#4.36 B#5.36 B#6.36 B#7.36 RN1.2 RN1#2.2 RN1#3.2 RN1#4.2 RN1#5.2 RN1#6.2 RN1#7.2
$1N4659: B.35 B#2.35 B#3.35 B#4.35 B#5.35 B#6.35 B#7.35 RN1.3 RN1#2.3 RN1#3.3 RN1#4.3 RN1#5.3 RN1#6.3 RN1#7.3
$1N4691: B.34 B#2.34 B#3.34 B#4.34 B#5.34 B#6.34 B#7.34 RN1.4 RN1#2.4 RN1#3.4 RN1#4.4 RN1#5.4 RN1#6.4 RN1#7.4
$1N4827: B.7 B#2.7 B#3.7 B#4.7 B#5.7 B#6.7 B#7.7 RN2.8 RN2#2.8 RN2#3.8 RN2#4.8 RN2#5.8 RN2#6.8 RN2#7.8
$1N4832: B.8 B#2.8 B#3.8 B#4.8 B#5.8 B#6.8 B#7.8 RN2.7 RN2#2.7 RN2#3.7 RN2#4.7 RN2#5.7 RN2#6.7 RN2#7.7
$1N4837: B.9 B#2.9 B#3.9 B#4.9 B#5.9 B#6.9 B#7.9 RN2.6 RN2#2.6 RN2#3.6 RN2#4.6 RN2#5.6 RN2#6.6 RN2#7.6
$1N4842: B.10 B#2.10 B#3.10 B#4.10 B#5.10 B#6.10 B#7.10 RN2.5 RN2#2.5 RN2#3.5 RN2#4.5 RN2#5.5 RN2#6.5 RN2#7.5

Pads without a net: B 1 2 3 4 14 15 16 17 25 26 27 28 29; B#2 1 2 3 4 14 15 16 17 25 26 27 28 29; B#3 1 2 3 4 14 15 16 17 25 26 27 28 29; B#4 1 2 3 4 14 15 16 17 25 26 27 28 29; B#5 1 2 3 4 14 15 16 17 25 26 27 28 29; B#6 1 2 3 4 14 15 16 17 25 26 27 28 29; B#7 1 2 3 4 14 15 16 17 25 26 27 28 29; LED1 3; LED1#2 3; LED1#3 3; LED1#4 3; LED1#5 3; LED1#6 3; LED1#7 3; LED2 3; LED2#2 3; LED2#3 3; LED2#4 3; LED2#5 3; LED2#6 3; LED2#7 3; LED3 3; LED3#2 3; LED3#3 3; LED3#4 3; LED3#5 3; LED3#6 3; LED3#7 3; LED4 8; LED4#2 8; LED4#3 8; LED4#4 8; LED4#5 8; LED4#6 8; LED4#7 8

## Via types
v1: diameter 0.45, hole 0.3, Top Layer to Bottom Layer, 721 vias

## Routing (per net, layer and track width the routed paths; a pad name or vN(x,y) marks a point on that pad's centre or on a via; arc(x,y) is an arc through that point)
3V3: length 774.6
  Top Layer w0.203: 59.35,4.9 58,4.9 52.4,10.5 52.4,11.24 B#5.18 ; 59.35,204.7 58,204.7 52.4,210.3 52.4,211.04 B#3.18 ; 16.85,38.2 16.92,38.2 18.3,36.82 21.2,36.82 21.8,37.42 24.08,37.42 26.45,39.8 33.75,39.8 35.35,38.2 ; 16.85,4.9 16.92,4.9 18.3,3.52 21.2,3.52 21.8,4.12 24.08,4.12 26.45,6.5 33.75,6.5 35.35,4.9 ; 59.35,138.1 58,138.1 52.4,143.7 52.4,144.44 B#6.18 ; 35.35,71.5 33.75,73.1 26.45,73.1 24.08,70.72 21.8,70.72 21.2,70.12 18.3,70.12 16.92,71.5 16.85,71.5 ; 16.85,171.4 16.92,171.4 18.3,170.02 21.2,170.02 21.8,170.62 24.08,170.62 26.45,173 33.75,173 35.35,171.4 ; 16.85,104.8 16.92,104.8 18.3,103.42 21.2,103.42 21.8,104.02 24.08,104.02 26.45,106.4 33.75,106.4 35.35,104.8 ; B#4.18 52.4,177.74 52.4,177 58,171.4 59.35,171.4 ; B#2.18 52.4,77.84 52.4,77.1 58,71.5 59.35,71.5 ; 59.35,104.8 58,104.8 52.4,110.4 52.4,111.14 B.18 ; B#7.18 52.4,44.54 52.4,43.8 58,38.2 59.35,38.2 ; 35.35,204.7 33.75,206.3 26.45,206.3 24.08,203.92 21.8,203.92 21.2,203.32 18.3,203.32 16.92,204.7 16.85,204.7 ; 16.85,138.1 16.92,138.1 18.3,136.72 21.2,136.72 21.8,137.32 24.08,137.32 26.45,139.7 33.75,139.7 35.35,138.1
  Top Layer w0.3: 62.95,110.1 53.94,110.1 B.18 ; B#3.18 53.94,210 62.95,210 ; 62.95,176.7 53.94,176.7 B#4.18 ; 35.35,138.1 36.1,138.85 36.1,145.3 35.3,146.1 24.1,146.1 23.4,145.4 23.4,144 22.2,142.8 5.88,142.8 4.6,141.52 2.7,141.52 2.1,142.12 2.1,142.3 ; 2.1,42.4 2.1,42.22 2.7,41.62 4.6,41.62 5.88,42.9 22.2,42.9 23.4,44.1 23.4,45.5 24.1,46.2 35.3,46.2 36.1,45.4 36.1,38.95 35.35,38.2 ; 2.1,42.4 2.15,42.4 ; 2.1,42.4 1.7,42.8 1.7,56.35 2.95,57.6 6.2,57.6 8.7,60.1 9.4,60.1 B#7.40 ; 2.1,208.9 2.1,208.72 2.7,208.12 4.6,208.12 5.88,209.4 22.2,209.4 23.4,210.6 23.4,212 24.1,212.7 35.3,212.7 36.1,211.9 36.1,205.45 35.35,204.7 ; 2.1,208.9 1.7,209.3 1.7,222.85 2.95,224.1 6.2,224.1 8.7,226.6 9.4,226.6 9.47,226.53 ; 2.1,208.9 2.15,208.9 ; 2.1,75.7 1.7,76.1 1.7,89.65 2.95,90.9 6.2,90.9 8.7,93.4 9.4,93.4 9.47,93.33 ; 2.1,75.7 2.1,75.52 2.7,74.92 4.6,74.92 5.88,76.2 22.2,76.2 23.4,77.4 23.4,78.8 24.1,79.5 35.3,79.5 36.1,78.7 36.1,72.25 35.35,71.5 ; 2.1,75.7 2.15,75.7 ; 2.1,9.1 2.15,9.1 ; 2.1,9.1 2.1,8.92 2.7,8.32 4.6,8.32 5.88,9.6 22.2,9.6 23.4,10.8 23.4,12.2 24.1,12.9 35.3,12.9 36.1,12.1 36.1,5.65 35.35,4.9 ; 2.1,9.1 1.7,9.5 1.7,23.05 2.95,24.3 6.2,24.3 8.7,26.8 9.4,26.8 9.47,26.73 ; 62.95,43.5 53.94,43.5 B#7.18 ; 2.1,142.3 2.15,142.3 ; 2.1,142.3 1.7,142.7 1.7,156.25 2.95,157.5 6.2,157.5 8.7,160 9.4,160 B#6.40 ; 2.1,175.6 2.15,175.6 ; 2.1,175.6 2.1,175.42 2.7,174.82 4.6,174.82 5.88,176.1 22.2,176.1 23.4,177.3 23.4,178.7 24.1,179.4 35.3,179.4 36.1,178.6 36.1,172.15 35.35,171.4 ; 2.1,175.6 1.7,176 1.7,189.55 2.95,190.8 6.2,190.8 8.7,193.3 9.4,193.3 B#4.40 ; B#5.18 53.94,10.2 62.95,10.2 ; B.40 9.4,126.7 8.7,126.7 6.2,124.2 2.95,124.2 1.7,122.95 1.7,109.4 2.1,109 ; B#6.18 53.94,143.4 62.95,143.4 ; 35.35,104.8 36.1,105.55 36.1,112 35.3,112.8 24.1,112.8 23.4,112.1 23.4,110.7 22.2,109.5 5.88,109.5 4.6,108.22 2.7,108.22 2.1,108.82 2.1,109 ; B#2.18 53.94,76.8 62.95,76.8 ; 2.1,109 2.15,109
3V32: length 157
  Top Layer w0.3: 64.45,176.7 64.45,177.28 64.45,177.29 64.45,177.67 v1(64.5,177.72) ; 64.45,43.5 64.45,44.08 64.45,44.09 64.45,44.47 v1(64.5,44.52) ; 64.45,110.1 64.45,110.68 64.45,110.69 64.45,111.07 v1(64.5,111.12) ; 64.45,210 64.45,210.58 64.45,210.59 64.45,210.97 v1(64.5,211.02) ; 64.45,10.2 64.45,10.78 64.45,10.79 64.45,11.17 v1(64.5,11.22) ; v1(64.5,77.82) 64.45,77.77 64.45,77.39 64.45,77.38 64.45,76.8 ; v1(64.5,144.42) 64.45,144.37 64.45,143.99 64.45,143.98 64.45,143.4
  Bottom Layer w0.3: 65.2,147.1 Q3.1 ; 65.2,147.1 65.5,147.4 ; 65.2,147.1 65.5,146.8 ; 65.2,13.9 65.5,14.2 ; 65.2,13.9 65.5,13.6 ; 65.2,13.9 Q3#3.1 ; 65.5,14.2 65.5,13.6 ; 65.5,14.2 65.5,17.2 ; 65.8,84.1 65.5,83.8 ; 65.8,84.1 65.5,84.4 ; 65.8,84.1 Q5#4.1 ; 65.5,83.8 65.5,84.4 ; 65.5,83.8 65.5,80.8 ; 65.2,113.8 65.5,114.1 ; 65.2,113.8 Q3#2.1 ; 65.2,113.8 65.5,113.5 ; 65.5,114.1 65.5,113.5 ; 65.5,114.1 65.5,117.1 ; 65.2,213.7 Q3#7.1 ; 65.2,213.7 65.5,213.4 ; 65.2,213.7 65.5,214 ; 65.5,53 65.2,53.3 ; 65.5,53 65.5,51.1 ; 65.5,53 65.5,53.6 ; 65.2,53.3 65.5,53.6 ; 65.2,53.3 Q4.1 ; 65.8,150.7 Q5#3.1 ; 65.8,150.7 65.5,151 ; 65.8,150.7 65.5,150.4 ; 65.2,219.8 Q4#3.1 ; 65.2,219.8 65.5,219.5 ; 65.2,219.8 65.5,220.1 ; 65.2,80.5 65.5,80.8 ; 65.2,80.5 Q3#6.1 ; 65.2,80.5 65.5,80.2 ; 65.5,80.8 65.5,80.2 ; 65.5,113.5 65.5,112.12 v1(64.5,111.12) ; 65.5,51.1 65.8,50.8 ; 65.5,51.1 65.5,50.5 ; 65.8,50.8 Q5#7.1 ; 65.8,50.8 65.5,50.5 ; 65.5,151 65.5,152.9 ; 65.5,151 65.5,150.4 ; 65.5,152.9 65.2,153.2 ; 65.5,152.9 65.5,153.5 ; 65.5,46.9 65.5,45.52 v1(64.5,44.52) ; 65.5,46.9 65.5,47.5 ; 65.5,46.9 65.2,47.2 ; 65.5,119.6 65.2,119.9 ; 65.5,119.6 65.5,120.2 ; 65.5,119.6 65.5,117.7 ; 65.2,119.9 Q4#7.1 ; 65.2,119.9 65.5,120.2 ; 65.5,180.1 65.5,180.7 ; 65.5,180.1 65.2,180.4 ; 65.5,180.1 65.5,178.72 v1(64.5,177.72) ; 65.5,180.7 65.5,183.7 ; 65.5,180.7 65.2,180.4 ; 65.5,53.6 65.5,55.1 67.3,56.9 Q2#4.1 ; 65.5,153.5 65.5,155 67.3,156.8 Q2#5.1 ; 65.5,153.5 65.2,153.2 ; 65.5,146.8 65.5,145.42 v1(64.5,144.42) ; 65.5,146.8 65.5,147.4 ; 65.2,186.5 Q4#5.1 ; 65.2,186.5 65.5,186.2 ; 65.2,186.5 65.5,186.8 ; 65.5,50.5 65.5,47.5 ; 65.5,219.5 65.5,217.6 ; 65.5,219.5 65.5,220.1 ; 65.8,17.5 65.5,17.2 ; 65.8,17.5 65.5,17.8 ; 65.8,17.5 Q5#6.1 ; 65.5,17.2 65.5,17.8 ; 65.2,86.6 Q4#2.1 ; 65.2,86.6 65.5,86.9 ; 65.2,86.6 65.5,86.3 ; 65.5,220.1 65.5,221.6 67.3,223.4 Q2#3.1 ; 65.5,47.5 65.2,47.2 ; 65.5,86.9 65.5,88.4 67.3,90.2 Q2#7.1 ; 65.5,86.9 65.5,86.3 ; 65.2,180.4 Q3#5.1 ; Q2.1 67.3,123.5 65.5,121.7 65.5,120.2 ; 65.5,17.8 65.5,19.7 ; 65.8,217.3 65.5,217 ; 65.8,217.3 65.5,217.6 ; 65.8,217.3 Q5#2.1 ; 65.5,217 65.5,217.6 ; 65.5,217 65.5,214 ; v1(64.5,11.22) 65.5,12.22 65.5,13.6 ; 65.5,186.2 65.5,186.8 ; 65.5,186.2 65.5,184.3 ; v1(64.5,77.82) 65.5,78.82 65.5,80.2 ; 65.5,183.7 65.5,184.3 ; 65.5,183.7 65.8,184 ; 65.5,147.4 65.5,150.4 ; 65.5,86.3 65.5,84.4 ; 65.5,117.7 65.8,117.4 ; 65.5,117.7 65.5,117.1 ; 65.8,117.4 Q5#5.1 ; 65.8,117.4 65.5,117.1 ; 65.2,153.2 Q4#4.1 ; 65.5,184.3 65.8,184 ; 65.8,184 Q5.1 ; 65.5,19.7 65.2,20 ; 65.5,19.7 65.5,20.3 ; 65.2,20 Q4#6.1 ; 65.2,20 65.5,20.3 ; Q2#2.1 67.3,23.6 65.5,21.8 65.5,20.3 ; 65.5,186.8 65.5,188.3 67.3,190.1 Q2#6.1 ; 65.5,213.4 65.5,212.02 v1(64.5,211.02) ; 65.5,213.4 65.5,214 ; 65.2,47.2 Q3#4.1
GND: length 16.1
  Top Layer w0.203: 40.6,4.9 v1(41.6,4.9) ; 40.6,138.1 v1(41.6,138.1) ; 40.6,204.7 v1(41.6,204.7) ; 11.5,138.1 v1(10.2,138.1) ; 40.6,38.2 v1(41.6,38.2) ; 11.5,171.4 v1(10.2,171.4) ; 11.5,38.2 v1(10.2,38.2) ; 40.6,104.8 v1(41.6,104.8) ; 11.5,71.5 v1(10.2,71.5) ; 11.5,204.7 v1(10.2,204.7) ; 11.5,4.9 v1(10.2,4.9) ; 40.6,71.5 v1(41.6,71.5) ; 11.5,104.8 v1(10.2,104.8) ; 40.6,171.4 v1(41.6,171.4)
  vias: v1(0.9,232.2) v1(0.9,198.9) v1(0.9,165.6) v1(0.9,132.3) v1(0.9,99) v1(0.9,65.7) v1(0.9,32.4) v1(1,206.82) v1(1,173.52) v1(1,140.22) v1(1,106.92) v1(1,73.62) v1(1,40.32) v1(1,7.02) v1(1.2,200.7) v1(1.2,167.4) v1(1.2,134.1) v1(1.2,100.8) v1(1.2,67.5) v1(1.2,34.2) v1(1.2,0.9) v1(3.4,217.1) v1(3.4,183.8) v1(3.4,150.5) v1(3.4,117.2) v1(3.4,83.9) v1(3.4,50.6) v1(3.4,17.3) v1(4.7,200.7) v1(4.7,167.4) v1(4.7,134.1) v1(4.7,100.8) v1(4.7,67.5) v1(4.7,34.2) v1(4.7,0.9) v1(5.2,223.3) v1(5.2,190) v1(5.2,156.7) v1(5.2,123.4) v1(5.2,90.1) v1(5.2,56.8) v1(5.2,23.5) v1(5.4,232.2) v1(5.4,198.9) v1(5.4,165.6) v1(5.4,132.3) v1(5.4,99) v1(5.4,65.7) v1(5.4,32.4) v1(5.9,208.02) v1(5.9,174.72) v1(5.9,141.42) v1(5.9,108.12) v1(5.9,74.82) v1(5.9,41.52) v1(5.9,8.22) v1(6.5,228.32) v1(6.5,195.02) v1(6.5,161.72) v1(6.5,128.42) v1(6.5,95.12) v1(6.5,61.82) v1(6.5,28.52) v1(8,223.9) v1(8,214.1) v1(8,190.6) v1(8,180.8) v1(8,157.3) v1(8,147.5) v1(8,124) v1(8,114.2) v1(8,90.7) v1(8,80.9) v1(8,57.4) v1(8,47.6) v1(8,24.1) v1(8,14.3) v1(13.7,206.3) v1(13.7,173) v1(13.7,139.7) v1(13.7,106.4) v1(13.7,73.1) v1(13.7,39.8) v1(13.7,6.5) v1(13.8,214.1) v1(13.8,180.8) v1(13.8,147.5) v1(13.8,114.2) v1(13.8,80.9) v1(13.8,47.6) v1(13.8,14.3) v1(14.4,224.8) v1(14.4,191.5) v1(14.4,158.2) v1(14.4,124.9) v1(14.4,91.6) v1(14.4,58.3) v1(14.4,25) v1(18.8,214.1) v1(18.8,180.8) v1(18.8,147.5) v1(18.8,114.2) v1(18.8,80.9) v1(18.8,47.6) v1(18.8,14.3) v1(19.4,224.8) v1(19.4,191.5) v1(19.4,158.2) v1(19.4,124.9) v1(19.4,91.6) v1(19.4,58.3) v1(19.4,25) v1(21.1,229.7) v1(21.1,196.4) v1(21.1,163.1) v1(21.1,129.8) v1(21.1,96.5) v1(21.1,63.2) v1(21.1,29.9) v1(21.8,228.1) v1(21.8,194.8) v1(21.8,161.5) v1(21.8,128.2) v1(21.8,94.9) v1(21.8,61.6) v1(21.8,28.3) v1(23.4,229.72) v1(23.4,196.42) v1(23.4,163.12) v1(23.4,129.82) v1(23.4,96.52) v1(23.4,63.22) v1(23.4,29.92) v1(23.8,214.1) v1(23.8,180.8) v1(23.8,147.5) v1(23.8,114.2) v1(23.8,80.9) v1(23.8,47.6) v1(23.8,14.3) v1(24.4,224.8) v1(24.4,191.5) v1(24.4,158.2) v1(24.4,124.9) v1(24.4,91.6) v1(24.4,58.3) v1(24.4,25) v1(26.6,207.1) v1(26.6,173.8) v1(26.6,140.5) v1(26.6,107.2) v1(26.6,73.9) v1(26.6,40.6) v1(26.6,7.3) v1(29.8,214.2) v1(29.8,180.9) v1(29.8,147.6) v1(29.8,114.3) v1(29.8,81) v1(29.8,47.7) v1(29.8,14.4) v1(29.9,223.22) v1(29.9,189.92) v1(29.9,156.62) v1(29.9,123.32) v1(29.9,90.02) v1(29.9,56.72) v1(29.9,23.42) v1(32.3,228.4) v1(32.3,195.1) v1(32.3,161.8) v1(32.3,128.5) v1(32.3,95.2) v1(32.3,61.9) v1(32.3,28.6) v1(33.7,204.7) v1(33.7,171.4) v1(33.7,138.1) v1(33.7,104.8) v1(33.7,71.5) v1(33.7,38.2) v1(33.7,4.9) v1(34.6,223.22) v1(34.6,189.92) v1(34.6,156.62) v1(34.6,123.32) v1(34.6,90.02) v1(34.6,56.72) v1(34.6,23.42) v1(34.7,214.2) v1(34.7,180.9) v1(34.7,147.6) v1(34.7,114.3) v1(34.7,81) v1(34.7,47.7) v1(34.7,14.4) v1(35,207.1) v1(35,173.8) v1(35,140.5) v1(35,107.2) v1(35,73.9) v1(35,40.6) v1(35,7.3) v1(38.7,206.72) v1(38.7,173.42) v1(38.7,140.12) v1(38.7,106.82) v1(38.7,73.52) v1(38.7,40.22) v1(38.7,6.92) v1(42.7,200.8) v1(42.7,167.5) v1(42.7,134.2) v1(42.7,100.9) v1(42.7,67.6) v1(42.7,34.3) v1(42.7,1) v1(43,230.9) v1(43,197.6) v1(43,164.3) v1(43,131) v1(43,97.7) v1(43,64.4) v1(43,31.1) v1(43.5,207.9) v1(43.5,174.6) v1(43.5,141.3) v1(43.5,108) v1(43.5,74.7) v1(43.5,41.4) v1(43.5,8.1) v1(44.5,222.62) v1(44.5,189.32) v1(44.5,156.02) v1(44.5,122.72) v1(44.5,89.42) v1(44.5,56.12) v1(44.5,22.82) v1(44.6,215.9) v1(44.6,182.6) v1(44.6,149.3) v1(44.6,116) v1(44.6,82.7) v1(44.6,49.4) v1(44.6,16.1) v1(46.7,230.4) v1(46.7,197.1) v1(46.7,163.8) v1(46.7,130.5) v1(46.7,97.2) v1(46.7,63.9) v1(46.7,30.6) v1(48.4,227.9) v1(48.4,194.6) v1(48.4,161.3) v1(48.4,128) v1(48.4,94.7) v1(48.4,61.4) v1(48.4,28.1) v1(48.7,206.3) v1(48.7,173) v1(48.7,139.7) v1(48.7,106.4) v1(48.7,73.1) v1(48.7,39.8) v1(48.7,6.5) v1(49.4,221.9) v1(49.4,215.9) v1(49.4,188.6) v1(49.4,182.6) v1(49.4,155.3) v1(49.4,149.3) v1(49.4,122) v1(49.4,116) v1(49.4,88.7) v1(49.4,82.7) v1(49.4,55.4) v1(49.4,49.4) v1(49.4,22.1) v1(49.4,16.1) v1(53.7,216.3) v1(53.7,183) v1(53.7,149.7) v1(53.7,116.4) v1(53.7,83.1) v1(53.7,49.8) v1(53.7,16.5) v1(53.8,230.2) v1(53.8,196.9) v1(53.8,163.6) v1(53.8,130.3) v1(53.8,97) v1(53.8,63.7) v1(53.8,30.4) v1(54.2,202.5) v1(54.2,169.2) v1(54.2,135.9) v1(54.2,102.6) v1(54.2,69.3) v1(54.2,36) v1(54.2,2.7) v1(55.7,207.9) v1(55.7,174.6) v1(55.7,141.3) v1(55.7,108) v1(55.7,74.7) v1(55.7,41.4) v1(55.7,8.1) v1(59.1,216.32) v1(59.1,183.02) v1(59.1,149.72) v1(59.1,116.42) v1(59.1,83.12) v1(59.1,49.82) v1(59.1,16.52) v1(60.4,226.9) v1(60.4,193.6) v1(60.4,160.3) v1(60.4,127) v1(60.4,93.7) v1(60.4,60.4) v1(60.4,27.1) v1(61.4,207.62) v1(61.4,174.32) v1(61.4,141.02) v1(61.4,107.72) v1(61.4,74.42) v1(61.4,41.12) v1(61.4,7.82) v1(62.2,225.5) v1(62.2,192.2) v1(62.2,158.9) v1(62.2,125.6) v1(62.2,92.3) v1(62.2,59) v1(62.2,25.7) v1(64.8,229.1) v1(64.8,195.8) v1(64.8,162.5) v1(64.8,129.2) v1(64.8,95.9) v1(64.8,62.6) v1(64.8,29.3) v1(66.6,204.6) v1(66.6,171.3) v1(66.6,138) v1(66.6,104.7) v1(66.6,71.4) v1(66.6,38.1) v1(66.6,4.8) v1(67.6,210.6) v1(67.6,201.8) v1(67.6,177.3) v1(67.6,168.5) v1(67.6,144) v1(67.6,135.2) v1(67.6,110.7) v1(67.6,101.9) v1(67.6,77.4) v1(67.6,68.6) v1(67.6,44.1) v1(67.6,35.3) v1(67.6,10.8) v1(67.6,2) v1(70.1,207.5) v1(70.1,174.2) v1(70.1,140.9) v1(70.1,107.6) v1(70.1,74.3) v1(70.1,41) v1(70.1,7.7) v1(72.2,225.5) v1(72.2,192.2) v1(72.2,158.9) v1(72.2,125.6) v1(72.2,92.3) v1(72.2,59) v1(72.2,25.7) v1(73.8,217.4) v1(73.8,184.1) v1(73.8,150.8) v1(73.8,117.5) v1(73.8,84.2) v1(73.8,50.9) v1(73.8,17.6) v1(74.8,220.8) v1(74.8,187.5) v1(74.8,154.2) v1(74.8,120.9) v1(74.8,87.6) v1(74.8,54.3) v1(74.8,21) v1(77.8,205.5) v1(77.8,172.2) v1(77.8,138.9) v1(77.8,105.6) v1(77.8,72.3) v1(77.8,39) v1(77.8,5.7) v1(78.7,221.3) v1(78.7,211.3) v1(78.7,188) v1(78.7,178) v1(78.7,154.7) v1(78.7,144.7) v1(78.7,121.4) v1(78.7,111.4) v1(78.7,88.1) v1(78.7,78.1) v1(78.7,54.8) v1(78.7,44.8) v1(78.7,21.5) v1(78.7,11.5) v1(82.2,205.5) v1(82.2,172.2) v1(82.2,138.9) v1(82.2,105.6) v1(82.2,72.3) v1(82.2,39) v1(82.2,5.7) v1(82.3,209.32) v1(82.3,176.02) v1(82.3,142.72) v1(82.3,109.42) v1(82.3,76.12) v1(82.3,42.82) v1(82.3,9.52) v1(83.7,226.3) v1(83.7,221.3) v1(83.7,216.3) v1(83.7,193) v1(83.7,188) v1(83.7,183) v1(83.7,159.7) v1(83.7,154.7) v1(83.7,149.7) v1(83.7,126.4) v1(83.7,121.4) v1(83.7,116.4) v1(83.7,93.1) v1(83.7,88.1) v1(83.7,83.1) v1(83.7,59.8) v1(83.7,54.8) v1(83.7,49.8) v1(83.7,26.5) v1(83.7,21.5) v1(83.7,16.5) v1(88.3,208.6) v1(88.3,205.7) v1(88.3,175.3) v1(88.3,172.4) v1(88.3,142) v1(88.3,139.1) v1(88.3,108.7) v1(88.3,105.8) v1(88.3,75.4) v1(88.3,72.5) v1(88.3,42.1) v1(88.3,39.2) v1(88.3,8.8) v1(88.3,5.9) v1(90.5,200.7) v1(90.5,167.4) v1(90.5,134.1) v1(90.5,100.8) v1(90.5,67.5) v1(90.5,34.2) v1(90.5,0.9) v1(90.6,232.2) v1(90.6,198.9) v1(90.6,165.6) v1(90.6,132.3) v1(90.6,99) v1(90.6,65.7) v1(90.6,32.4) v1(94.8,232.2) v1(94.8,228) v1(94.8,219.4) v1(94.8,214.8) v1(94.8,198.9) v1(94.8,194.7) v1(94.8,186.1) v1(94.8,181.5) v1(94.8,165.6) v1(94.8,161.4) v1(94.8,152.8) v1(94.8,148.2) v1(94.8,132.3) v1(94.8,128.1) v1(94.8,119.5) v1(94.8,114.9) v1(94.8,99) v1(94.8,94.8) v1(94.8,86.2) v1(94.8,81.6) v1(94.8,65.7) v1(94.8,61.5) v1(94.8,52.9) v1(94.8,48.3) v1(94.8,32.4) v1(94.8,28.2) v1(94.8,19.6) v1(94.8,15) v1(94.9,209.7) v1(94.9,204) v1(94.9,176.4) v1(94.9,170.7) v1(94.9,143.1) v1(94.9,137.4) v1(94.9,109.8) v1(94.9,104.1) v1(94.9,76.5) v1(94.9,70.8) v1(94.9,43.2) v1(94.9,37.5) v1(94.9,9.9) v1(94.9,4.2) v1(95,200.7) v1(95,167.4) v1(95,134.1) v1(95,100.8) v1(95,67.5) v1(95,34.2) v1(95,0.9)
VCC: length 881.4
  Top Layer w0.25: R9#4.2 66.3,143.42 67.1,142.62 v1(67.1,142.52) ; v1(67.1,9.32) 67.1,9.42 66.3,10.22 R9#7.2 ; v1(67.1,209.12) 67.1,209.22 66.3,210.02 R9.2 ; R9#5.2 66.3,43.52 67.1,42.72 v1(67.1,42.62) ; R9#6.2 66.3,76.82 67.1,76.02 v1(67.1,75.92) ; R9#3.2 66.3,176.72 67.1,175.92 v1(67.1,175.82) ; v1(67.1,109.22) 67.1,109.32 66.3,110.12 R9#2.2
  Top Layer w0.3: B#4.38 13.12,191.8 8.2,191.8 5.5,189.1 5.5,182.2 7.6,180.1 37.9,180.1 38.7,179.3 38.7,174.5 39.7,173.5 41.2,173.5 42.4,172.3 42.4,170.9 v1(42.3,170.8) ; v1(42.3,104.2) 42.4,104.3 42.4,105.7 41.2,106.9 39.7,106.9 38.7,107.9 38.7,112.7 37.9,113.5 7.6,113.5 5.5,115.6 5.5,122.5 8.2,125.2 13.12,125.2 B.38 ; 14.55,226.53 13.12,225.1 8.2,225.1 5.5,222.4 5.5,215.5 7.6,213.4 37.9,213.4 38.7,212.6 38.7,207.8 39.7,206.8 41.2,206.8 42.4,205.6 42.4,204.2 v1(42.3,204.1) ; 14.55,93.33 13.12,91.9 8.2,91.9 5.5,89.2 5.5,82.3 7.6,80.2 37.9,80.2 38.7,79.4 38.7,74.6 39.7,73.6 41.2,73.6 42.4,72.4 42.4,71 v1(42.3,70.9) ; 14.55,26.73 13.12,25.3 8.2,25.3 5.5,22.6 5.5,15.7 7.6,13.6 37.9,13.6 38.7,12.8 38.7,8 39.7,7 41.2,7 42.4,5.8 42.4,4.4 v1(42.3,4.3) ; v1(42.3,37.6) 42.4,37.7 42.4,39.1 41.2,40.3 39.7,40.3 38.7,41.3 38.7,46.1 37.9,46.9 7.6,46.9 5.5,49 5.5,55.9 8.2,58.6 13.12,58.6 B#7.38 ; v1(42.3,137.5) 42.4,137.6 42.4,139 41.2,140.2 39.7,140.2 38.7,141.2 38.7,146 37.9,146.8 7.6,146.8 5.5,148.9 5.5,155.8 8.2,158.5 13.12,158.5 B#6.38
  Top Layer w0.4: U1#2.1 72.89,177.41 74.43,178.95 84,178.95 DC#3.1 ; U1#6.1 72.89,10.91 74.43,12.45 84,12.45 DC#5.1 ; DC#2.1 84,145.65 74.43,145.65 72.89,144.11 U1#5.1 ; U1#7.1 72.89,77.51 74.43,79.05 84,79.05 DC.1 ; U1.1 72.89,110.81 74.43,112.35 84,112.35 DC#4.1 ; DC#6.1 84,212.25 74.43,212.25 72.89,210.71 U1#3.1 ; DC#7.1 84,45.75 74.43,45.75 72.89,44.21 U1#4.1
  Bottom Layer w0.203: 80.6,190.1 84.4,186.3 DC#3.1 ; 80.6,56.9 84.4,53.1 DC#7.1 ; 80.6,156.8 84.4,153 DC#2.1 ; DC#6.1 84.4,219.6 80.6,223.4 ; 80.6,23.6 84.4,19.8 DC#5.1 ; DC.1 84.4,86.4 80.6,90.2 ; DC#4.1 84.4,119.7 80.6,123.5
  Bottom Layer w0.3: v1(42.3,170.8) 42.4,170.9 42.4,172.2 43.9,173.7 57.7,173.7 59.82,175.82 v1(67.1,175.82) ; v1(42.3,137.5) 42.4,137.6 42.4,138.9 43.9,140.4 57.7,140.4 59.82,142.52 v1(67.1,142.52) ; v1(67.1,209.12) 59.82,209.12 57.7,207 43.9,207 42.4,205.5 42.4,204.2 v1(42.3,204.1) ; v1(67.1,109.22) 59.82,109.22 57.7,107.1 43.9,107.1 42.4,105.6 42.4,104.3 v1(42.3,104.2) ; v1(67.1,9.32) 59.82,9.32 57.7,7.2 43.9,7.2 42.4,5.7 42.4,4.4 v1(42.3,4.3) ; v1(42.3,37.6) 42.4,37.7 42.4,39 43.9,40.5 57.7,40.5 59.82,42.62 v1(67.1,42.62) ; v1(42.3,70.9) 42.4,71 42.4,72.3 43.9,73.8 57.7,73.8 59.82,75.92 v1(67.1,75.92)
  Bottom Layer w0.4: v1(67.1,9.32) 72.06,9.32 U1#6.1 ; U1#4.1 72.06,42.62 v1(67.1,42.62) ; v1(67.1,175.82) 72.06,175.82 U1#2.1 ; U1.1 72.06,109.22 v1(67.1,109.22) ; v1(67.1,142.52) 72.06,142.52 U1#5.1 ; U1#7.1 72.06,75.92 v1(67.1,75.92) ; v1(67.1,209.12) 72.06,209.12 U1#3.1
A: length 791.1
  Top Layer w0.203: v1(53.5,24.1) 51.4,26.2 51.4,27.5 52.6,28.7 54.51,28.7 57.46,31.65 57.46,31.94 ; v1(37.6,136.4) 37.6,135.6 38.54,134.66 ; v1(37.6,103.1) 37.6,102.3 38.54,101.36 ; v1(37.6,203) 37.6,202.2 38.54,201.26 ; v1(53.5,57.4) 51.4,59.5 51.4,60.8 52.6,62 54.51,62 57.46,64.95 57.46,65.24 ; 3.9,170.32 3.9,169.72 4.2,169.42 8.72,169.42 8.94,169.2 13.3,169.2 14.54,167.96 ; v1(79.3,29.6) 81.46,31.76 81.46,31.94 ; 38.54,1.46 37.6,2.4 v1(37.6,3.2) ; v1(37.6,69.8) 37.6,69 38.54,68.06 ; 14.54,101.36 13.3,102.6 8.94,102.6 8.72,102.82 4.2,102.82 3.9,103.12 3.9,103.72 ; 81.46,198.44 81.46,198.26 v1(79.3,196.1) ; 57.46,231.74 57.46,231.45 54.51,228.5 52.6,228.5 51.4,227.3 51.4,226 v1(53.5,223.9) ; 57.46,98.54 57.46,98.25 54.51,95.3 52.6,95.3 51.4,94.1 51.4,92.8 v1(53.5,90.7) ; 3.9,137.02 3.9,136.42 4.2,136.12 8.72,136.12 8.94,135.9 13.3,135.9 14.54,134.66 ; v1(79.3,162.8) 81.46,164.96 81.46,165.14 ; v1(53.5,190.6) 51.4,192.7 51.4,194 52.6,195.2 54.51,195.2 57.46,198.15 57.46,198.44 ; 38.54,167.96 37.6,168.9 v1(37.6,169.7) ; 3.9,3.82 3.9,3.22 4.2,2.92 8.72,2.92 8.94,2.7 13.3,2.7 14.54,1.46 ; 3.9,203.62 3.9,203.02 4.2,202.72 8.72,202.72 8.94,202.5 13.3,202.5 14.54,201.26 ; 14.54,68.06 13.3,69.3 8.94,69.3 8.72,69.52 4.2,69.52 3.9,69.82 3.9,70.42 ; 81.46,98.54 81.46,98.36 v1(79.3,96.2) ; 81.46,231.74 81.46,231.56 v1(79.3,229.4) ; 38.54,34.76 37.6,35.7 v1(37.6,36.5) ; v1(79.3,62.9) 81.46,65.06 81.46,65.24 ; 81.46,131.84 81.46,131.66 v1(79.3,129.5) ; 57.46,165.14 57.46,164.85 54.51,161.9 52.6,161.9 51.4,160.7 51.4,159.4 v1(53.5,157.3) ; 3.9,37.12 3.9,36.52 4.2,36.22 8.72,36.22 8.94,36 13.3,36 14.54,34.76 ; 57.46,131.84 57.46,131.55 54.51,128.6 52.6,128.6 51.4,127.4 51.4,126.1 v1(53.5,124)
  Bottom Layer w0.203: 57.46,231.74 59.1,230.1 66,230.1 67.3,231.4 76.1,231.4 77.8,229.7 79,229.7 v1(79.3,229.4) ; 57.46,165.14 59.1,163.5 66,163.5 67.3,164.8 76.1,164.8 77.8,163.1 79,163.1 v1(79.3,162.8) ; 57.46,131.84 59.1,130.2 66,130.2 67.3,131.5 76.1,131.5 77.8,129.8 79,129.8 v1(79.3,129.5) ; 14.54,167.96 15.83,169.25 17.55,169.25 19.1,167.7 28.3,167.7 30.2,169.6 37.5,169.6 v1(37.6,169.7) 37.6,176 38.7,177.1 38.7,178.8 39.6,179.7 46,179.7 46.9,180.6 46.9,189.1 48.6,190.8 53.3,190.8 v1(53.5,190.6) ; 14.54,101.36 15.83,102.65 17.55,102.65 19.1,101.1 28.3,101.1 30.2,103 37.5,103 v1(37.6,103.1) 37.6,109.4 38.7,110.5 38.7,112.2 39.6,113.1 46,113.1 46.9,114 46.9,122.5 48.6,124.2 53.3,124.2 v1(53.5,124) ; 14.54,134.66 15.83,135.95 17.55,135.95 19.1,134.4 28.3,134.4 30.2,136.3 37.5,136.3 v1(37.6,136.4) 37.6,142.7 38.7,143.8 38.7,145.5 39.6,146.4 46,146.4 46.9,147.3 46.9,155.8 48.6,157.5 53.3,157.5 v1(53.5,157.3) ; v1(79.3,62.9) 79,63.2 77.8,63.2 76.1,64.9 67.3,64.9 66,63.6 59.1,63.6 57.46,65.24 ; v1(79.3,96.2) 79,96.5 77.8,96.5 76.1,98.2 67.3,98.2 66,96.9 59.1,96.9 57.46,98.54 ; v1(79.3,29.6) 79,29.9 77.8,29.9 76.1,31.6 67.3,31.6 66,30.3 59.1,30.3 57.46,31.94 ; v1(79.3,196.1) 79,196.4 77.8,196.4 76.1,198.1 67.3,198.1 66,196.8 59.1,196.8 57.46,198.44 ; 14.54,201.26 15.83,202.55 17.55,202.55 19.1,201 28.3,201 30.2,202.9 37.5,202.9 v1(37.6,203) 37.6,209.3 38.7,210.4 38.7,212.1 39.6,213 46,213 46.9,213.9 46.9,222.4 48.6,224.1 53.3,224.1 v1(53.5,223.9) ; v1(53.5,57.4) 53.3,57.6 48.6,57.6 46.9,55.9 46.9,47.4 46,46.5 39.6,46.5 38.7,45.6 38.7,43.9 37.6,42.8 v1(37.6,36.5) 37.5,36.4 30.2,36.4 28.3,34.5 19.1,34.5 17.55,36.05 15.83,36.05 14.54,34.76 ; 14.54,1.46 15.83,2.75 17.55,2.75 19.1,1.2 28.3,1.2 30.2,3.1 37.5,3.1 v1(37.6,3.2) 37.6,9.5 38.7,10.6 38.7,12.3 39.6,13.2 46,13.2 46.9,14.1 46.9,22.6 48.6,24.3 53.3,24.3 v1(53.5,24.1) ; 14.54,68.06 15.83,69.35 17.55,69.35 19.1,67.8 28.3,67.8 30.2,69.7 37.5,69.7 v1(37.6,69.8) 37.6,76.1 38.7,77.2 38.7,78.9 39.6,79.8 46,79.8 46.9,80.7 46.9,89.2 48.6,90.9 53.3,90.9 v1(53.5,90.7)
B: length 802.3
  Top Layer w0.203: 54.92,165.14 54.92,163.02 54.3,162.4 50.59,162.4 48.9,160.71 48.9,159.3 49.5,158.7 51.1,158.7 v1(52.8,157) ; 78.92,231.74 77.28,230.1 v1(76.4,230.1) ; v1(76.4,30.3) 77.28,30.3 78.92,31.94 ; v1(52.8,190.3) 51.1,192 49.5,192 48.9,192.6 48.9,194.01 50.59,195.7 54.3,195.7 54.92,196.32 54.92,198.44 ; 17.08,68.06 15.82,69.32 14,69.32 13.6,69.72 9.22,69.72 9.02,69.93 5.16,69.93 4.8,70.28 RN2#4.4 4.7,70.42 ; 17.08,101.36 15.82,102.62 14,102.62 13.6,103.02 9.22,103.02 9.02,103.23 5.16,103.23 4.8,103.58 RN2#5.4 4.7,103.72 ; v1(76.4,196.8) 77.28,196.8 78.92,198.44 ; 54.92,31.94 54.92,29.82 54.3,29.2 50.59,29.2 48.9,27.51 48.9,26.1 49.5,25.5 51.1,25.5 v1(52.8,23.8) ; 54.92,231.74 54.92,229.62 54.3,229 50.59,229 48.9,227.31 48.9,225.9 49.5,225.3 51.1,225.3 v1(52.8,223.6) ; v1(52.8,90.4) 51.1,92.1 49.5,92.1 48.9,92.7 48.9,94.11 50.59,95.8 54.3,95.8 54.92,96.42 54.92,98.54 ; 54.92,131.84 54.92,129.72 54.3,129.1 50.59,129.1 48.9,127.41 48.9,126 49.5,125.4 51.1,125.4 v1(52.8,123.7) ; 78.92,165.14 77.28,163.5 v1(76.4,163.5) ; 17.08,34.76 15.82,36.02 14,36.02 13.6,36.42 9.22,36.42 9.02,36.63 5.16,36.63 4.8,36.98 RN2#2.4 4.7,37.12 ; 17.08,134.66 15.82,135.92 14,135.92 13.6,136.32 9.22,136.32 9.02,136.53 5.16,136.53 4.8,136.88 RN2#6.4 4.7,137.02 ; v1(76.4,130.2) 77.28,130.2 78.92,131.84 ; v1(52.8,57.1) 51.1,58.8 49.5,58.8 48.9,59.4 48.9,60.81 50.59,62.5 54.3,62.5 54.92,63.12 54.92,65.24 ; 17.08,1.46 15.82,2.72 14,2.72 13.6,3.12 9.22,3.12 9.02,3.33 5.16,3.33 4.8,3.68 RN2.4 4.7,3.82 ; 17.08,167.96 15.82,169.22 14,169.22 13.6,169.62 9.22,169.62 9.02,169.83 5.16,169.83 4.8,170.18 RN2#7.4 4.7,170.32 ; v1(76.4,63.6) 77.28,63.6 78.92,65.24 ; 17.08,201.26 15.82,202.52 14,202.52 13.6,202.92 9.22,202.92 9.02,203.13 5.16,203.13 4.8,203.48 RN2#3.4 4.7,203.62 ; 78.92,98.54 77.28,96.9 v1(76.4,96.9)
  Bottom Layer w0.203: 38.4,169.43 38.17,169.2 ; 38.4,169.43 38.4,169.9 38,170.3 38,175.7 38.9,176.6 40.4,176.6 41.1,177.3 41.1,178.8 41.6,179.3 46.3,179.3 47.4,180.4 47.4,189 48.8,190.4 52.7,190.4 v1(52.8,190.3) ; 38.4,169.43 38.63,169.2 ; 38.17,169.2 30.4,169.2 28.5,167.3 18.8,167.3 18.14,167.96 17.08,167.96 ; 38.17,169.2 38.63,169.2 ; v1(52.8,157) 52.7,157.1 48.8,157.1 47.4,155.7 47.4,147.1 46.3,146 41.6,146 41.1,145.5 41.1,144 40.4,143.3 38.9,143.3 38,142.4 38,137 38.4,136.6 38.4,136.13 ; 54.92,98.54 56.96,96.5 66.4,96.5 67.6,97.7 75.6,97.7 v1(76.4,96.9) ; 54.92,31.94 56.96,29.9 66.4,29.9 67.6,31.1 75.6,31.1 v1(76.4,30.3) ; 17.08,201.26 18.14,201.26 18.8,200.6 28.5,200.6 30.4,202.5 38.17,202.5 ; 38.17,2.7 30.4,2.7 28.5,0.8 18.8,0.8 18.14,1.46 17.08,1.46 ; 38.17,2.7 38.63,2.7 ; 38.17,2.7 38.4,2.93 ; v1(52.8,23.8) 52.7,23.9 48.8,23.9 47.4,22.5 47.4,13.9 46.3,12.8 41.6,12.8 41.1,12.3 41.1,10.8 40.4,10.1 38.9,10.1 38,9.2 38,3.8 38.4,3.4 38.4,2.93 ; 38.4,202.73 38.63,202.5 ; 38.4,202.73 38.17,202.5 ; 38.4,202.73 38.4,203.2 38,203.6 38,209 38.9,209.9 40.4,209.9 41.1,210.6 41.1,212.1 41.6,212.6 46.3,212.6 47.4,213.7 47.4,222.3 48.8,223.7 52.7,223.7 v1(52.8,223.6) ; 38.63,202.5 38.17,202.5 ; 38.63,202.5 39.84,202.5 41.08,201.26 ; 17.08,134.66 18.14,134.66 18.8,134 28.5,134 30.4,135.9 38.17,135.9 ; 38.17,135.9 38.63,135.9 ; 38.17,135.9 38.4,136.13 ; 38.63,135.9 39.84,135.9 41.08,134.66 ; 38.63,135.9 38.4,136.13 ; v1(76.4,130.2) 75.6,131 67.6,131 66.4,129.8 56.96,129.8 54.92,131.84 ; v1(76.4,163.5) 75.6,164.3 67.6,164.3 66.4,163.1 56.96,163.1 54.92,165.14 ; 38.63,102.6 39.84,102.6 41.08,101.36 ; 38.63,102.6 38.17,102.6 ; 38.63,102.6 38.4,102.83 ; 38.63,169.2 39.84,169.2 41.08,167.96 ; 41.08,34.76 39.84,36 38.63,36 ; 38.63,2.7 39.84,2.7 41.08,1.46 ; 38.63,2.7 38.4,2.93 ; 17.08,101.36 18.14,101.36 18.8,100.7 28.5,100.7 30.4,102.6 38.17,102.6 ; 38.17,102.6 38.4,102.83 ; 38.63,69.3 39.84,69.3 41.08,68.06 ; 38.63,69.3 38.17,69.3 ; 38.63,69.3 38.4,69.53 ; 38.17,36 38.63,36 ; 38.17,36 30.4,36 28.5,34.1 18.8,34.1 18.14,34.76 17.08,34.76 ; 38.17,36 38.4,36.23 ; 38.63,36 38.4,36.23 ; 54.92,231.74 56.96,229.7 66.4,229.7 67.6,230.9 75.6,230.9 v1(76.4,230.1) ; 54.92,198.44 56.96,196.4 66.4,196.4 67.6,197.6 75.6,197.6 v1(76.4,196.8) ; 38.4,102.83 38.4,103.3 38,103.7 38,109.1 38.9,110 40.4,110 41.1,110.7 41.1,112.2 41.6,112.7 46.3,112.7 47.4,113.8 47.4,122.4 48.8,123.8 52.7,123.8 v1(52.8,123.7) ; 38.4,36.23 38.4,36.7 38,37.1 38,42.5 38.9,43.4 40.4,43.4 41.1,44.1 41.1,45.6 41.6,46.1 46.3,46.1 47.4,47.2 47.4,55.8 48.8,57.2 52.7,57.2 v1(52.8,57.1) ; 17.08,68.06 18.14,68.06 18.8,67.4 28.5,67.4 30.4,69.3 38.17,69.3 ; 38.4,69.53 38.4,70 38,70.4 38,75.8 38.9,76.7 40.4,76.7 41.1,77.4 41.1,78.9 41.6,79.4 46.3,79.4 47.4,80.5 47.4,89.1 48.8,90.5 52.7,90.5 v1(52.8,90.4) ; 38.4,69.53 38.17,69.3 ; v1(76.4,63.6) 75.6,64.4 67.6,64.4 66.4,63.2 56.96,63.2 54.92,65.24
